# EAGLE design Mainboard (EAGLE 9.3.0)

## Sheet 1 of 3: Pro Micro and Misc. IO
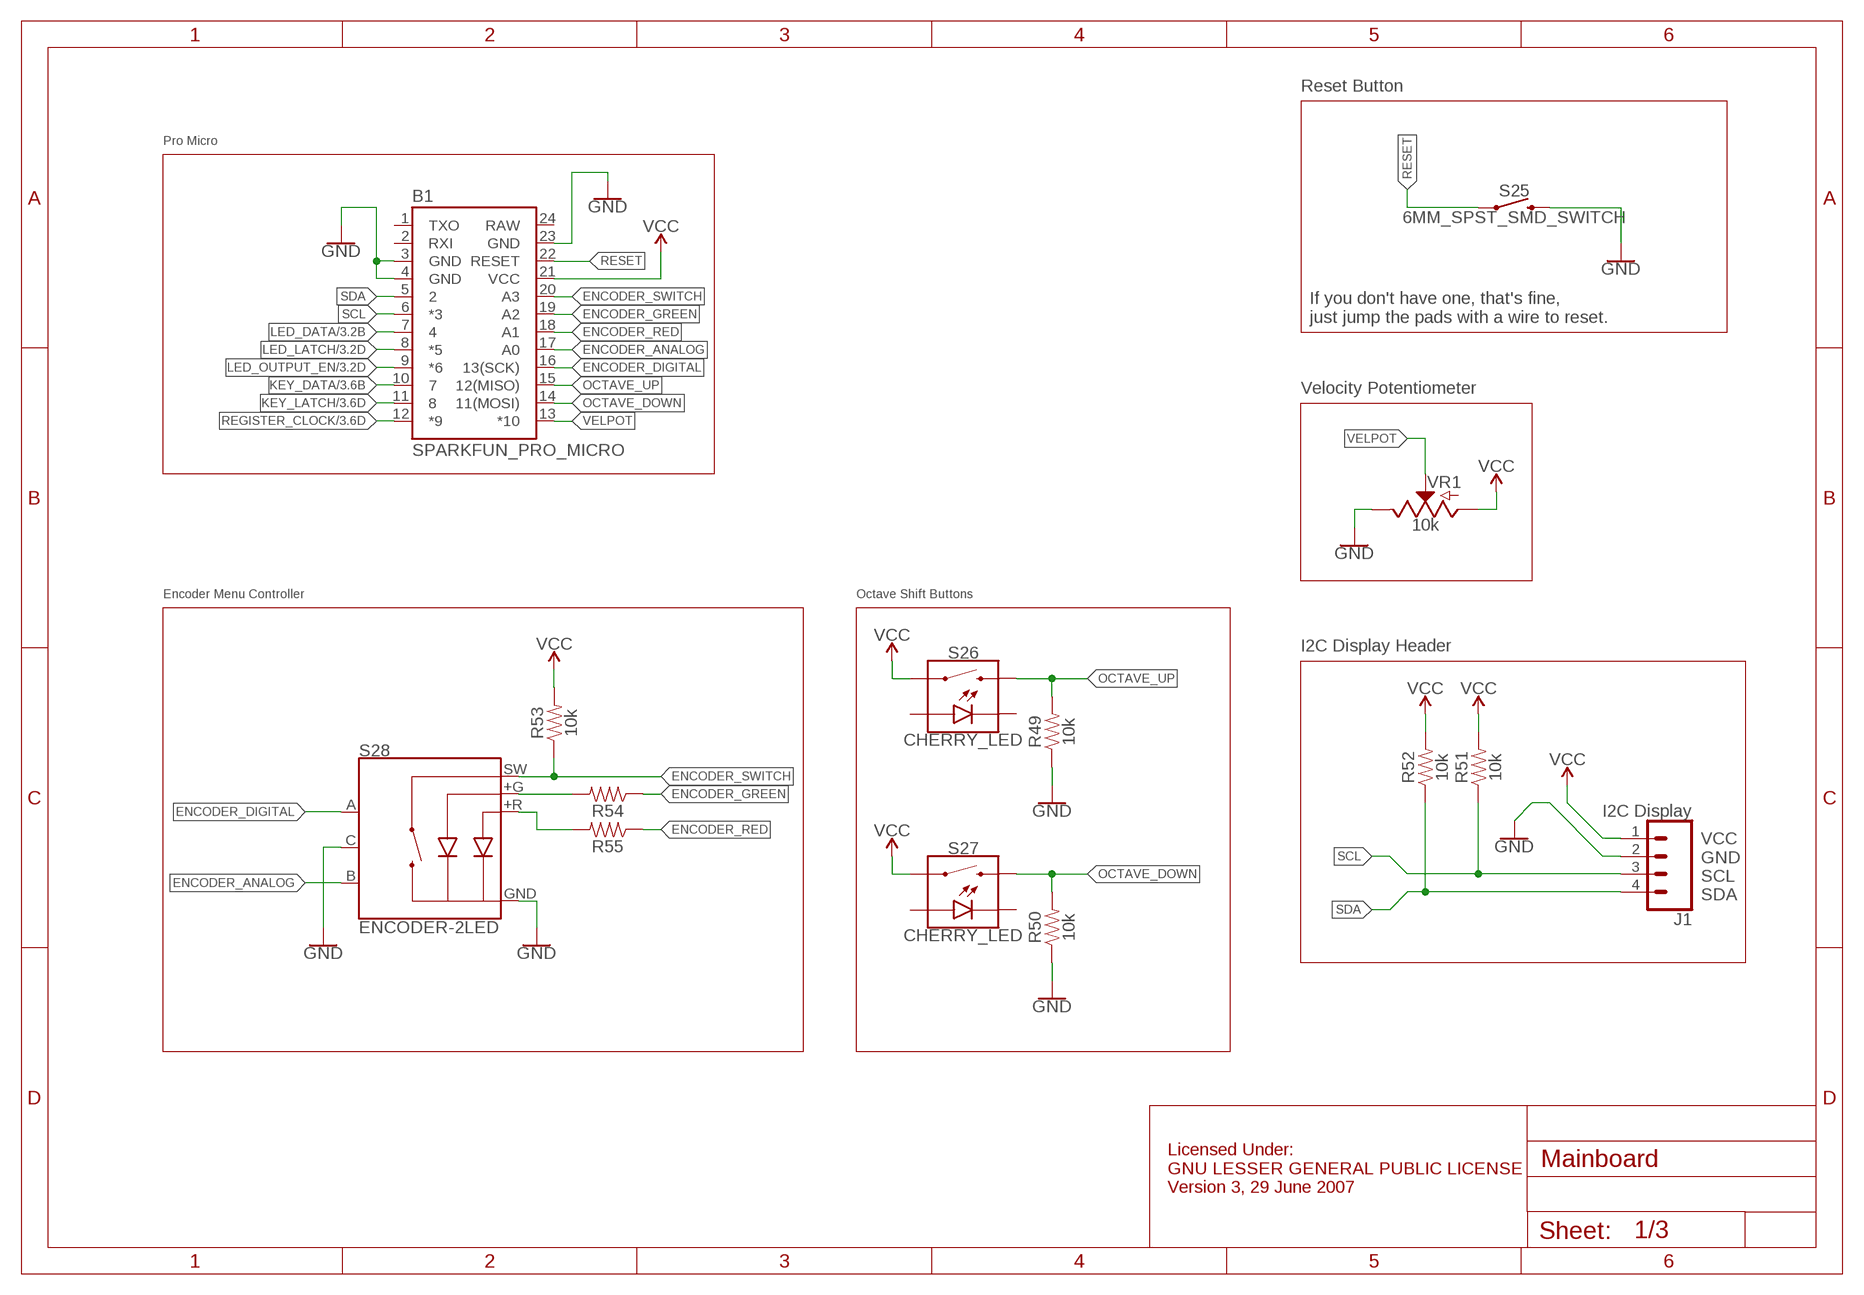
[diagram p0: schematic, sheet 1]

### Parts
B1  SPARKFUN_PRO_MICRO  [SPARKFUN_PRO_MICRO]
J1  I2C Display  CONN_04  [1X04]
R49  10k  10KOHM-HORIZ-1/4W-1%  [AXIAL-0.3]
R50  10k  10KOHM-HORIZ-1/4W-1%  [AXIAL-0.3]
R51  10k  10KOHM-HORIZ-1/4W-1%  [AXIAL-0.3]
R52  10k  10KOHM-HORIZ-1/4W-1%  [AXIAL-0.3]
R53  10k  10KOHM-HORIZ-1/4W-1%  [AXIAL-0.3]
R54  RESISTORAXIAL-0.3  [AXIAL-0.3]
R55  RESISTORAXIAL-0.3  [AXIAL-0.3]
S25  6MM_SPST_SMD_SWITCH  MOMENTARY-SWITCH-SPST-SMD-6.0X3.5MM  [TACTILE_SWITCH_SMD_6.0X3.5MM]
S26  CHERRY_LED  MOMENTARY-SWITCH-SPST-LED-PTH-CHERRY  [CHERRY-MX-LED]
S27  CHERRY_LED  MOMENTARY-SWITCH-SPST-LED-PTH-CHERRY  [CHERRY-MX-LED]
S28  ENCODER-2LED  [ENCODER_LED_2]
VR1  10k  POTENTIOMETER-PTH-9MM-1/20W-20%  [POT-PTH-ALPS]

### Nets
ENCODER_ANALOG: B1.17(A0) S28.B
ENCODER_DIGITAL: B1.16(13(SCK)) S28.A
ENCODER_GREEN: B1.19(A2) R54.P$1
ENCODER_RED: B1.18(A1) R55.P$1
ENCODER_SWITCH: B1.20(A3) R53.P$1 S28.SW
GND: B1.3(GND) B1.4(GND) B1.23(GND) J1.2 R49.P$1 R50.P$1 S25.2 S28.C S28.GND(-) VR1.P$1(E) ; also sheet 2,3
KEY_DATA: B1.10 ; also sheet 3
KEY_LATCH: B1.11 ; also sheet 3
LED_DATA: B1.7 ; also sheet 3
LED_LATCH: B1.8(*5) ; also sheet 3
LED_OUTPUT_EN: B1.9(*6) ; also sheet 3
N$25: R54.P$2 S28.+G
N$26: R55.P$2 S28.+R
OCTAVE_DOWN: B1.14(11(MOSI)) R50.P$2 S27.S2
OCTAVE_UP: B1.15(12(MISO)) R49.P$2 S26.S2
REGISTER_CLOCK: B1.12(*9) ; also sheet 3
RESET: B1.22(RESET) S25.1
SCL: B1.6(*3) J1.3 R51.P$1
SDA: B1.5 J1.4 R52.P$1
VCC: B1.21(VCC) J1.1 R51.P$2 R52.P$2 R53.P$2 S26.S1 S27.S1 VR1.P$3(A) ; also sheet 2,3
VELPOT: B1.13(*10) VR1.P$2(S)
Unconnected: B1.1(TXO) B1.2(RXI) S26.A S26.K(C) S27.A S27.K(C)

### Notes on the sheet
- Reset Button
- Pro Micro
- If you don't have one, that's fine,
  just jump the pads with a wire to reset.
- Velocity Potentiometer
- Encoder Menu Controller | Octave Shift Buttons
- I2C Display Header
- VCC
  GND
  SCL
  SDA
- Licensed Under:
  GNU LESSER GENERAL PUBLIC LICENSE
  Version 3, 29 June 2007

## Sheet 2 of 3: Keyswitches
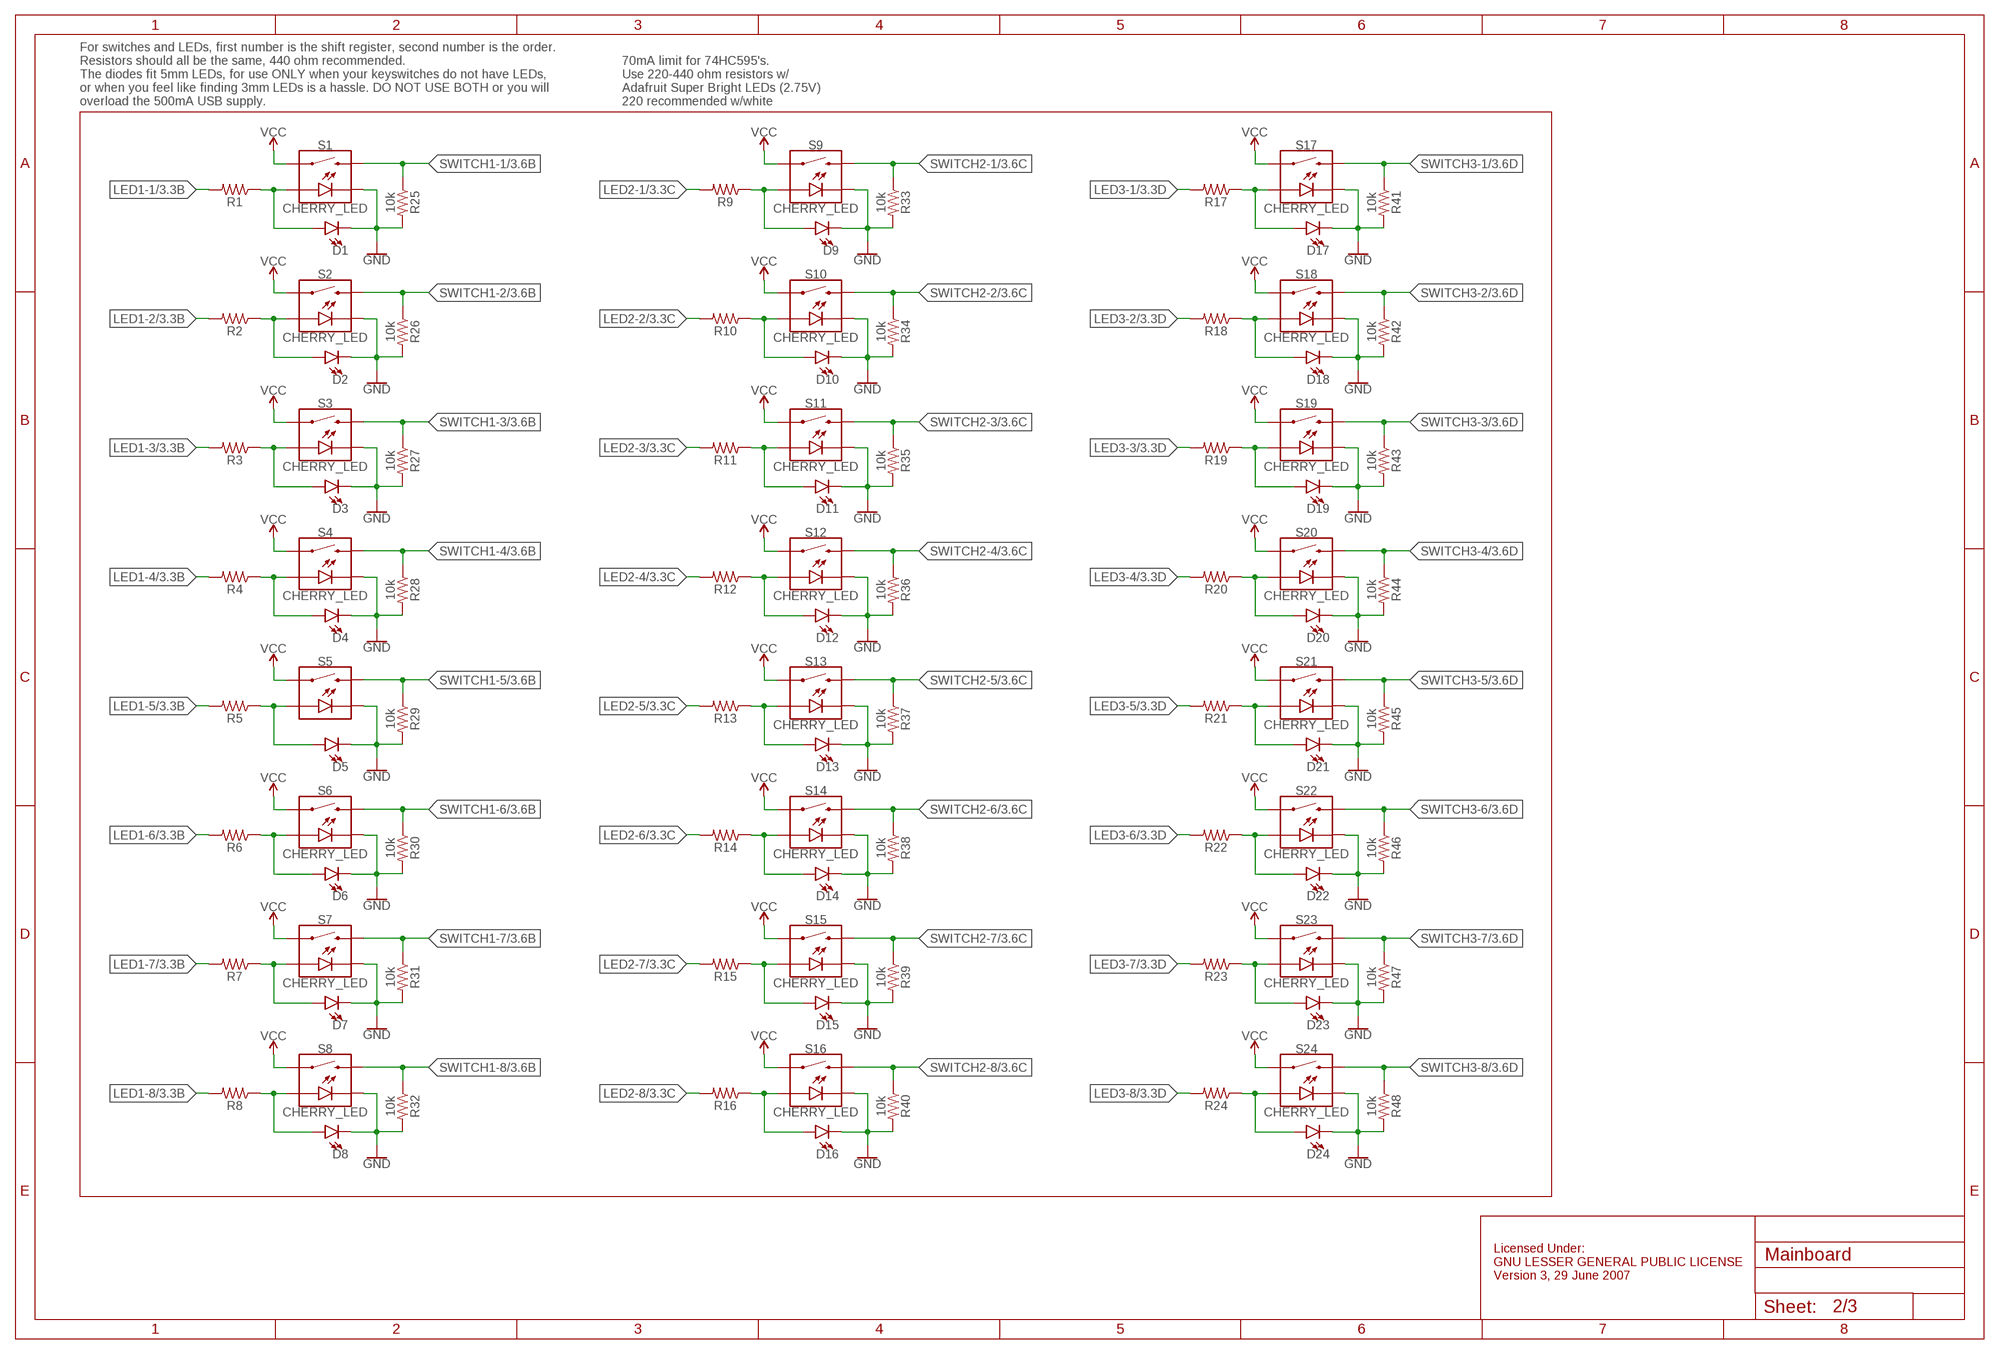
[diagram p1: schematic, sheet 2]

### Parts
D1  LED5MM  [LED_5MM]
D2  LED5MM  [LED_5MM]
D3  LED5MM  [LED_5MM]
D4  LED5MM  [LED_5MM]
D5  LED5MM  [LED_5MM]
D6  LED5MM  [LED_5MM]
D7  LED5MM  [LED_5MM]
D8  LED5MM  [LED_5MM]
D9  LED5MM  [LED_5MM]
D10  LED5MM  [LED_5MM]
D11  LED5MM  [LED_5MM]
D12  LED5MM  [LED_5MM]
D13  LED5MM  [LED_5MM]
D14  LED5MM  [LED_5MM]
D15  LED5MM  [LED_5MM]
D16  LED5MM  [LED_5MM]
D17  LED5MM  [LED_5MM]
D18  LED5MM  [LED_5MM]
D19  LED5MM  [LED_5MM]
D20  LED5MM  [LED_5MM]
D21  LED5MM  [LED_5MM]
D22  LED5MM  [LED_5MM]
D23  LED5MM  [LED_5MM]
D24  LED5MM  [LED_5MM]
R1  RESISTORAXIAL-0.3  [AXIAL-0.3]
R2  RESISTORAXIAL-0.3  [AXIAL-0.3]
R3  RESISTORAXIAL-0.3  [AXIAL-0.3]
R4  RESISTORAXIAL-0.3  [AXIAL-0.3]
R5  RESISTORAXIAL-0.3  [AXIAL-0.3]
R6  RESISTORAXIAL-0.3  [AXIAL-0.3]
R7  RESISTORAXIAL-0.3  [AXIAL-0.3]
R8  RESISTORAXIAL-0.3  [AXIAL-0.3]
R9  RESISTORAXIAL-0.3  [AXIAL-0.3]
R10  RESISTORAXIAL-0.3  [AXIAL-0.3]
R11  RESISTORAXIAL-0.3  [AXIAL-0.3]
R12  RESISTORAXIAL-0.3  [AXIAL-0.3]
R13  RESISTORAXIAL-0.3  [AXIAL-0.3]
R14  RESISTORAXIAL-0.3  [AXIAL-0.3]
R15  RESISTORAXIAL-0.3  [AXIAL-0.3]
R16  RESISTORAXIAL-0.3  [AXIAL-0.3]
R17  RESISTORAXIAL-0.3  [AXIAL-0.3]
R18  RESISTORAXIAL-0.3  [AXIAL-0.3]
R19  RESISTORAXIAL-0.3  [AXIAL-0.3]
R20  RESISTORAXIAL-0.3  [AXIAL-0.3]
R21  RESISTORAXIAL-0.3  [AXIAL-0.3]
R22  RESISTORAXIAL-0.3  [AXIAL-0.3]
R23  RESISTORAXIAL-0.3  [AXIAL-0.3]
R24  RESISTORAXIAL-0.3  [AXIAL-0.3]
R25  10k  10KOHM-HORIZ-1/4W-1%  [AXIAL-0.3]
R26  10k  10KOHM-HORIZ-1/4W-1%  [AXIAL-0.3]
R27  10k  10KOHM-HORIZ-1/4W-1%  [AXIAL-0.3]
R28  10k  10KOHM-HORIZ-1/4W-1%  [AXIAL-0.3]
R29  10k  10KOHM-HORIZ-1/4W-1%  [AXIAL-0.3]
R30  10k  10KOHM-HORIZ-1/4W-1%  [AXIAL-0.3]
R31  10k  10KOHM-HORIZ-1/4W-1%  [AXIAL-0.3]
R32  10k  10KOHM-HORIZ-1/4W-1%  [AXIAL-0.3]
R33  10k  10KOHM-HORIZ-1/4W-1%  [AXIAL-0.3]
R34  10k  10KOHM-HORIZ-1/4W-1%  [AXIAL-0.3]
R35  10k  10KOHM-HORIZ-1/4W-1%  [AXIAL-0.3]
R36  10k  10KOHM-HORIZ-1/4W-1%  [AXIAL-0.3]
R37  10k  10KOHM-HORIZ-1/4W-1%  [AXIAL-0.3]
R38  10k  10KOHM-HORIZ-1/4W-1%  [AXIAL-0.3]
R39  10k  10KOHM-HORIZ-1/4W-1%  [AXIAL-0.3]
R40  10k  10KOHM-HORIZ-1/4W-1%  [AXIAL-0.3]
R41  10k  10KOHM-HORIZ-1/4W-1%  [AXIAL-0.3]
R42  10k  10KOHM-HORIZ-1/4W-1%  [AXIAL-0.3]
R43  10k  10KOHM-HORIZ-1/4W-1%  [AXIAL-0.3]
R44  10k  10KOHM-HORIZ-1/4W-1%  [AXIAL-0.3]
R45  10k  10KOHM-HORIZ-1/4W-1%  [AXIAL-0.3]
R46  10k  10KOHM-HORIZ-1/4W-1%  [AXIAL-0.3]
R47  10k  10KOHM-HORIZ-1/4W-1%  [AXIAL-0.3]
R48  10k  10KOHM-HORIZ-1/4W-1%  [AXIAL-0.3]
S1  CHERRY_LED  MOMENTARY-SWITCH-SPST-LED-PTH-CHERRY  [CHERRY-MX-LED]
S2  CHERRY_LED  MOMENTARY-SWITCH-SPST-LED-PTH-CHERRY  [CHERRY-MX-LED]
S3  CHERRY_LED  MOMENTARY-SWITCH-SPST-LED-PTH-CHERRY  [CHERRY-MX-LED]
S4  CHERRY_LED  MOMENTARY-SWITCH-SPST-LED-PTH-CHERRY  [CHERRY-MX-LED]
S5  MOMENTARY-SWITCH-SPST-LED-PTH-CHERRY  [CHERRY-MX-LED]
S6  CHERRY_LED  MOMENTARY-SWITCH-SPST-LED-PTH-CHERRY  [CHERRY-MX-LED]
S7  CHERRY_LED  MOMENTARY-SWITCH-SPST-LED-PTH-CHERRY  [CHERRY-MX-LED]
S8  CHERRY_LED  MOMENTARY-SWITCH-SPST-LED-PTH-CHERRY  [CHERRY-MX-LED]
S9  CHERRY_LED  MOMENTARY-SWITCH-SPST-LED-PTH-CHERRY  [CHERRY-MX-LED]
S10  CHERRY_LED  MOMENTARY-SWITCH-SPST-LED-PTH-CHERRY  [CHERRY-MX-LED]
S11  CHERRY_LED  MOMENTARY-SWITCH-SPST-LED-PTH-CHERRY  [CHERRY-MX-LED]
S12  CHERRY_LED  MOMENTARY-SWITCH-SPST-LED-PTH-CHERRY  [CHERRY-MX-LED]
S13  CHERRY_LED  MOMENTARY-SWITCH-SPST-LED-PTH-CHERRY  [CHERRY-MX-LED]
S14  CHERRY_LED  MOMENTARY-SWITCH-SPST-LED-PTH-CHERRY  [CHERRY-MX-LED]
S15  CHERRY_LED  MOMENTARY-SWITCH-SPST-LED-PTH-CHERRY  [CHERRY-MX-LED]
S16  CHERRY_LED  MOMENTARY-SWITCH-SPST-LED-PTH-CHERRY  [CHERRY-MX-LED]
S17  CHERRY_LED  MOMENTARY-SWITCH-SPST-LED-PTH-CHERRY  [CHERRY-MX-LED]
S18  CHERRY_LED  MOMENTARY-SWITCH-SPST-LED-PTH-CHERRY  [CHERRY-MX-LED]
S19  CHERRY_LED  MOMENTARY-SWITCH-SPST-LED-PTH-CHERRY  [CHERRY-MX-LED]
S20  CHERRY_LED  MOMENTARY-SWITCH-SPST-LED-PTH-CHERRY  [CHERRY-MX-LED]
S21  CHERRY_LED  MOMENTARY-SWITCH-SPST-LED-PTH-CHERRY  [CHERRY-MX-LED]
S22  CHERRY_LED  MOMENTARY-SWITCH-SPST-LED-PTH-CHERRY  [CHERRY-MX-LED]
S23  CHERRY_LED  MOMENTARY-SWITCH-SPST-LED-PTH-CHERRY  [CHERRY-MX-LED]
S24  CHERRY_LED  MOMENTARY-SWITCH-SPST-LED-PTH-CHERRY  [CHERRY-MX-LED]

### Nets
GND: D1.K(C) D2.K(C) D3.K(C) D4.K(C) D5.K(C) D6.K(C) D7.K(C) D8.K(C) D9.K(C) D10.K(C) D11.K(C) D12.K(C) D13.K(C) D14.K(C) D15.K(C) D16.K(C) D17.K(C) D18.K(C) D19.K(C) D20.K(C) D21.K(C) D22.K(C) D23.K(C) D24.K(C) R25.P$2 R26.P$2 R27.P$2 R28.P$2 R29.P$2 R30.P$2 R31.P$2 R32.P$2 R33.P$2 R34.P$2 R35.P$2 R36.P$2 R37.P$2 R38.P$2 R39.P$2 R40.P$2 R41.P$2 R42.P$2 R43.P$2 R44.P$2 R45.P$2 R46.P$2 R47.P$2 R48.P$2 S1.K(C) S2.K(C) S3.K(C) S4.K(C) S5.K(C) S6.K(C) S7.K(C) S8.K(C) S9.K(C) S10.K(C) S11.K(C) S12.K(C) S13.K(C) S14.K(C) S15.K(C) S16.K(C) S17.K(C) S18.K(C) S19.K(C) S20.K(C) S21.K(C) S22.K(C) S23.K(C) S24.K(C) ; also sheet 1,3
LED1-1: R1.P$2 ; also sheet 3
LED1-2: R2.P$2 ; also sheet 3
LED1-3: R3.P$2 ; also sheet 3
LED1-4: R4.P$2 ; also sheet 3
LED1-5: R5.P$2 ; also sheet 3
LED1-6: R6.P$2 ; also sheet 3
LED1-7: R7.P$2 ; also sheet 3
LED1-8: R8.P$2 ; also sheet 3
LED2-1: R9.P$2 ; also sheet 3
LED2-2: R10.P$2 ; also sheet 3
LED2-3: R11.P$2 ; also sheet 3
LED2-4: R12.P$2 ; also sheet 3
LED2-5: R13.P$2 ; also sheet 3
LED2-6: R14.P$2 ; also sheet 3
LED2-7: R15.P$2 ; also sheet 3
LED2-8: R16.P$2 ; also sheet 3
LED3-1: R17.P$2 ; also sheet 3
LED3-2: R18.P$2 ; also sheet 3
LED3-3: R19.P$2 ; also sheet 3
LED3-4: R20.P$2 ; also sheet 3
LED3-5: R21.P$2 ; also sheet 3
LED3-6: R22.P$2 ; also sheet 3
LED3-7: R23.P$2 ; also sheet 3
LED3-8: R24.P$2 ; also sheet 3
N$1: D1.A R1.P$1 S1.A
N$2: D2.A R2.P$1 S2.A
N$3: D3.A R3.P$1 S3.A
N$4: D4.A R4.P$1 S4.A
N$5: D5.A R5.P$1 S5.A
N$6: D6.A R6.P$1 S6.A
N$7: D7.A R7.P$1 S7.A
N$8: D8.A R8.P$1 S8.A
N$9: D9.A R9.P$1 S9.A
N$10: D10.A R10.P$1 S10.A
N$11: D11.A R11.P$1 S11.A
N$12: D12.A R12.P$1 S12.A
N$13: D13.A R13.P$1 S13.A
N$14: D14.A R14.P$1 S14.A
N$15: D15.A R15.P$1 S15.A
N$16: D16.A R16.P$1 S16.A
N$17: D17.A R17.P$1 S17.A
N$18: D18.A R18.P$1 S18.A
N$19: D19.A R19.P$1 S19.A
N$20: D20.A R20.P$1 S20.A
N$21: D21.A R21.P$1 S21.A
N$22: D22.A R22.P$1 S22.A
N$23: D23.A R23.P$1 S23.A
N$24: D24.A R24.P$1 S24.A
SWITCH1-1: R25.P$1 S1.S2 ; also sheet 3
SWITCH1-2: R26.P$1 S2.S2 ; also sheet 3
SWITCH1-3: R27.P$1 S3.S2 ; also sheet 3
SWITCH1-4: R28.P$1 S4.S2 ; also sheet 3
SWITCH1-5: R29.P$1 S5.S2 ; also sheet 3
SWITCH1-6: R30.P$1 S6.S2 ; also sheet 3
SWITCH1-7: R31.P$1 S7.S2 ; also sheet 3
SWITCH1-8: R32.P$1 S8.S2 ; also sheet 3
SWITCH2-1: R33.P$1 S9.S2 ; also sheet 3
SWITCH2-2: R34.P$1 S10.S2 ; also sheet 3
SWITCH2-3: R35.P$1 S11.S2 ; also sheet 3
SWITCH2-4: R36.P$1 S12.S2 ; also sheet 3
SWITCH2-5: R37.P$1 S13.S2 ; also sheet 3
SWITCH2-6: R38.P$1 S14.S2 ; also sheet 3
SWITCH2-7: R39.P$1 S15.S2 ; also sheet 3
SWITCH2-8: R40.P$1 S16.S2 ; also sheet 3
SWITCH3-1: R41.P$1 S17.S2 ; also sheet 3
SWITCH3-2: R42.P$1 S18.S2 ; also sheet 3
SWITCH3-3: R43.P$1 S19.S2 ; also sheet 3
SWITCH3-4: R44.P$1 S20.S2 ; also sheet 3
SWITCH3-5: R45.P$1 S21.S2 ; also sheet 3
SWITCH3-6: R46.P$1 S22.S2 ; also sheet 3
SWITCH3-7: R47.P$1 S23.S2 ; also sheet 3
SWITCH3-8: R48.P$1 S24.S2 ; also sheet 3
VCC: S1.S1 S2.S1 S3.S1 S4.S1 S5.S1 S6.S1 S7.S1 S8.S1 S9.S1 S10.S1 S11.S1 S12.S1 S13.S1 S14.S1 S15.S1 S16.S1 S17.S1 S18.S1 S19.S1 S20.S1 S21.S1 S22.S1 S23.S1 S24.S1 ; also sheet 1,3

### Notes on the sheet
- For switches and LEDs, first number is the shift register, second number is the order.
  Resistors should all be the same, 440 ohm recommended. 
  The diodes fit 5mm LEDs, for use ONLY when your keyswitches do not have LEDs,
  or when you feel like finding 3mm LEDs is a hassle. DO NOT USE BOTH or you will
  overload the 500mA USB supply.
- 70mA limit for 74HC595's.
  Use 220-440 ohm resistors w/ 
  Adafruit Super Bright LEDs (2.75V)
  220 recommended w/white
- Licensed Under:
  GNU LESSER GENERAL PUBLIC LICENSE
  Version 3, 29 June 2007

## Sheet 3 of 3: Shift Registers
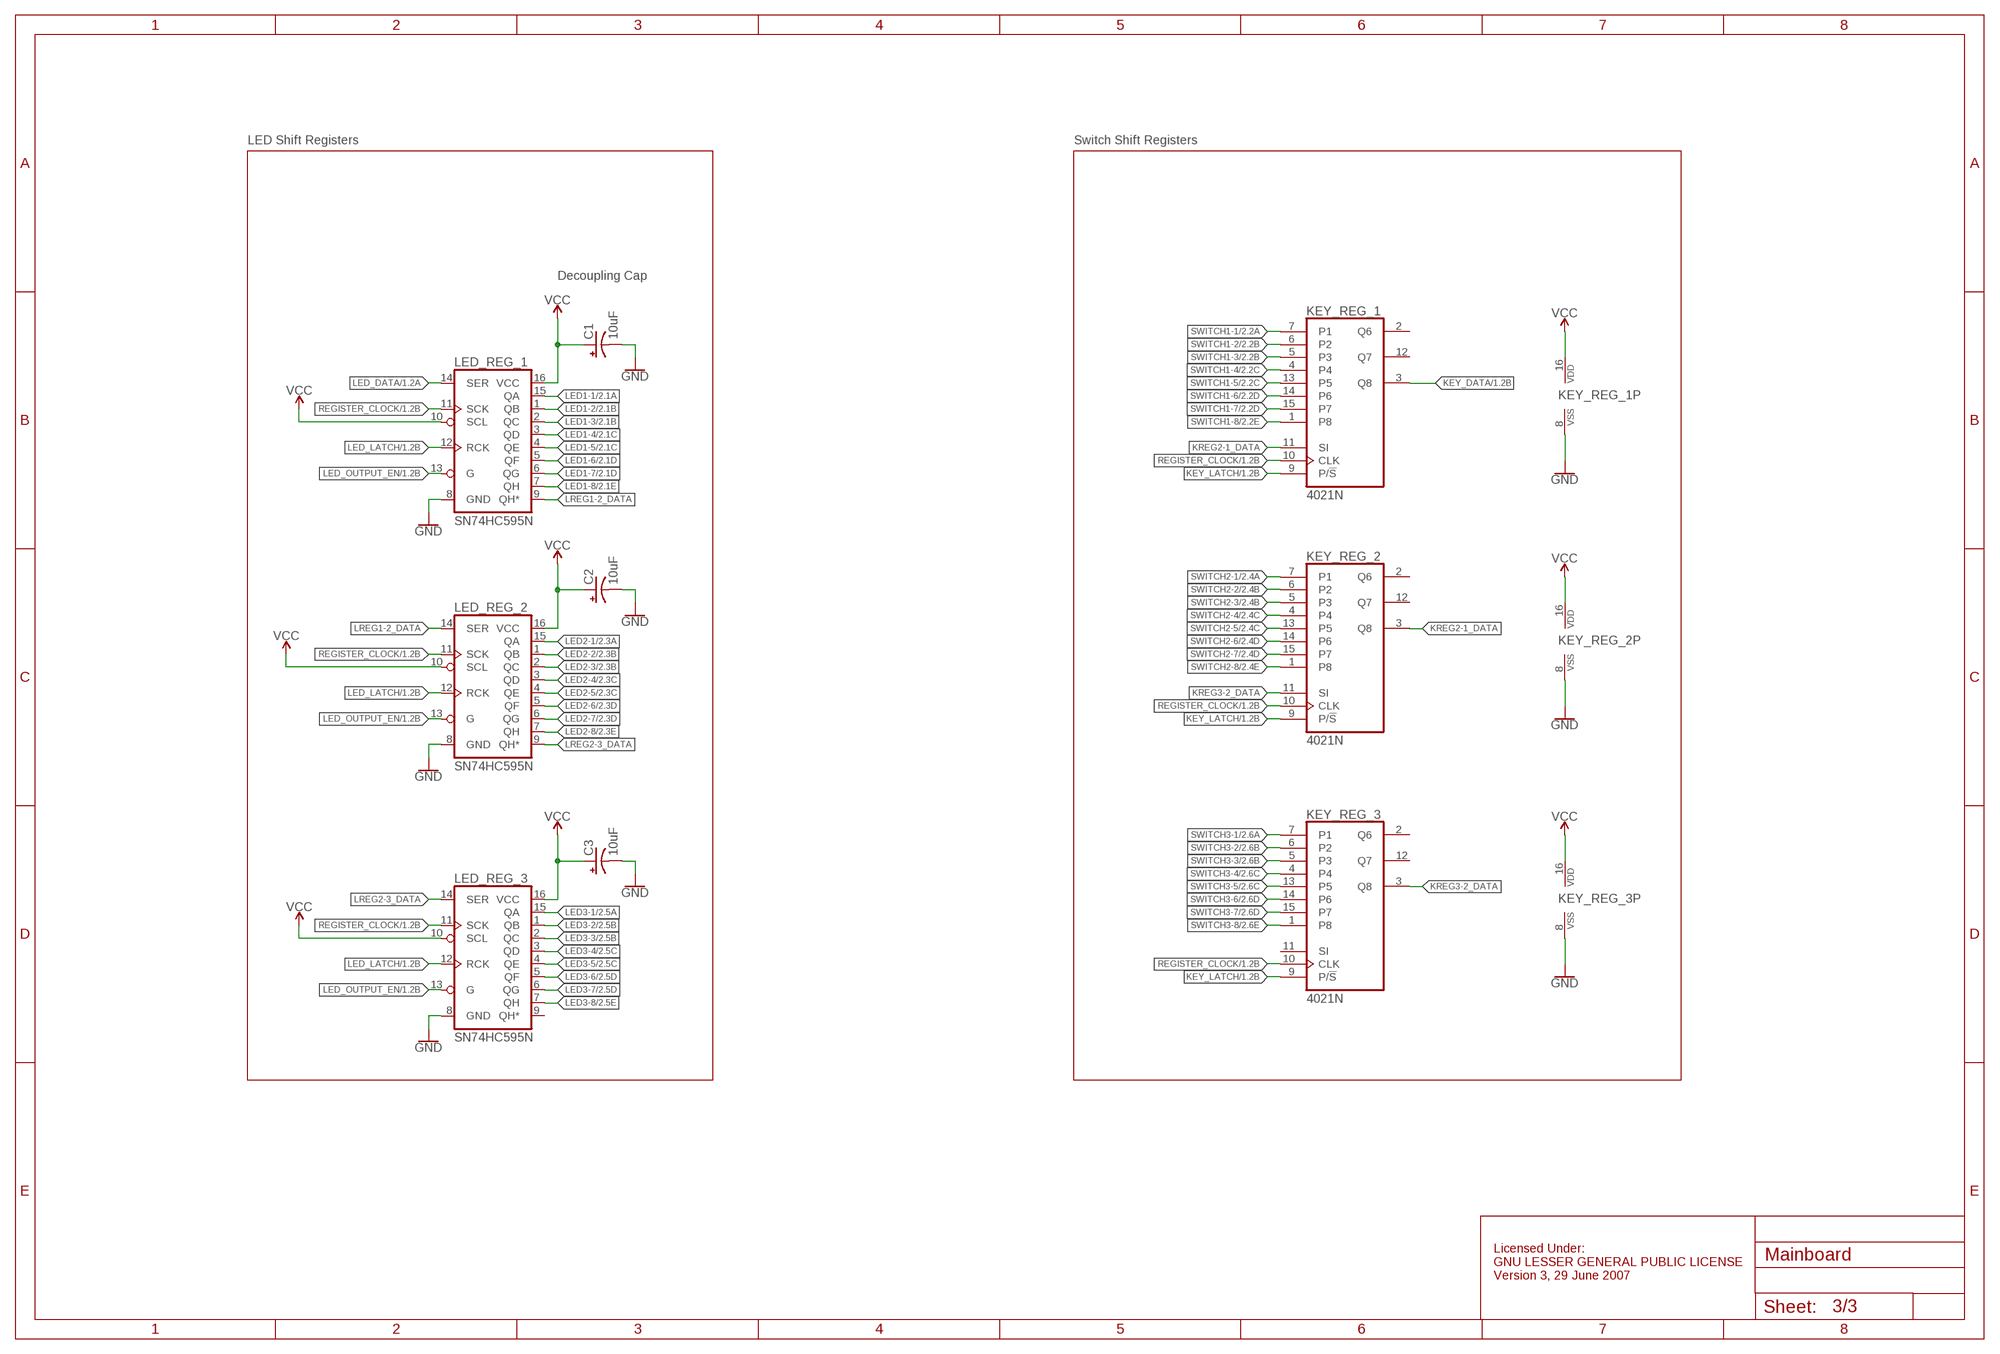
[diagram p2: schematic, sheet 3]

### Parts
C1  10uF  10UF-POLAR-RADIAL-2.5MM-25V-20%  [CPOL-RADIAL-2.5MM-5MM]
C2  10uF  10UF-POLAR-RADIAL-2.5MM-25V-20%  [CPOL-RADIAL-2.5MM-5MM]
C3  10uF  10UF-POLAR-RADIAL-2.5MM-25V-20%  [CPOL-RADIAL-2.5MM-5MM]
KEY_REG_1  4021N  [DIL16]
KEY_REG_2  4021N  [DIL16]
KEY_REG_3  4021N  [DIL16]
LED_REG_1  SN74HC595N  74HC595N  [DIP16]
LED_REG_2  SN74HC595N  74HC595N  [DIP16]
LED_REG_3  SN74HC595N  74HC595N  [DIP16]

### Nets
GND: C1.2(-) C2.2(-) C3.2(-) KEY_REG_1.8(VSS) KEY_REG_2.8(VSS) KEY_REG_3.8(VSS) LED_REG_1.8(GND) LED_REG_2.8(GND) LED_REG_3.8(GND) ; also sheet 1,2
KEY_DATA: KEY_REG_1.3(Q8) ; also sheet 1
KEY_LATCH: KEY_REG_1.9(P/!S) KEY_REG_2.9(P/!S) KEY_REG_3.9(P/!S) ; also sheet 1
KREG2-1_DATA: KEY_REG_1.11(SI) KEY_REG_2.3(Q8)
KREG3-2_DATA: KEY_REG_2.11(SI) KEY_REG_3.3(Q8)
LED1-1: LED_REG_1.15(QA) ; also sheet 2
LED1-2: LED_REG_1.1(QB) ; also sheet 2
LED1-3: LED_REG_1.2(QC) ; also sheet 2
LED1-4: LED_REG_1.3(QD) ; also sheet 2
LED1-5: LED_REG_1.4(QE) ; also sheet 2
LED1-6: LED_REG_1.5(QF) ; also sheet 2
LED1-7: LED_REG_1.6(QG) ; also sheet 2
LED1-8: LED_REG_1.7(QH) ; also sheet 2
LED2-1: LED_REG_2.15(QA) ; also sheet 2
LED2-2: LED_REG_2.1(QB) ; also sheet 2
LED2-3: LED_REG_2.2(QC) ; also sheet 2
LED2-4: LED_REG_2.3(QD) ; also sheet 2
LED2-5: LED_REG_2.4(QE) ; also sheet 2
LED2-6: LED_REG_2.5(QF) ; also sheet 2
LED2-7: LED_REG_2.6(QG) ; also sheet 2
LED2-8: LED_REG_2.7(QH) ; also sheet 2
LED3-1: LED_REG_3.15(QA) ; also sheet 2
LED3-2: LED_REG_3.1(QB) ; also sheet 2
LED3-3: LED_REG_3.2(QC) ; also sheet 2
LED3-4: LED_REG_3.3(QD) ; also sheet 2
LED3-5: LED_REG_3.4(QE) ; also sheet 2
LED3-6: LED_REG_3.5(QF) ; also sheet 2
LED3-7: LED_REG_3.6(QG) ; also sheet 2
LED3-8: LED_REG_3.7(QH) ; also sheet 2
LED_DATA: LED_REG_1.14(SER) ; also sheet 1
LED_LATCH: LED_REG_1.12(RCK) LED_REG_2.12(RCK) LED_REG_3.12(RCK) ; also sheet 1
LED_OUTPUT_EN: LED_REG_1.13(G) LED_REG_2.13(G) LED_REG_3.13(G) ; also sheet 1
LREG1-2_DATA: LED_REG_1.9(QH*) LED_REG_2.14(SER)
LREG2-3_DATA: LED_REG_2.9(QH*) LED_REG_3.14(SER)
REGISTER_CLOCK: KEY_REG_1.10(CLK) KEY_REG_2.10(CLK) KEY_REG_3.10(CLK) LED_REG_1.11(SCK) LED_REG_2.11(SCK) LED_REG_3.11(SCK) ; also sheet 1
SWITCH1-1: KEY_REG_1.7(P1) ; also sheet 2
SWITCH1-2: KEY_REG_1.6(P2) ; also sheet 2
SWITCH1-3: KEY_REG_1.5(P3) ; also sheet 2
SWITCH1-4: KEY_REG_1.4 ; also sheet 2
SWITCH1-5: KEY_REG_1.13(P5) ; also sheet 2
SWITCH1-6: KEY_REG_1.14(P6) ; also sheet 2
SWITCH1-7: KEY_REG_1.15(P7) ; also sheet 2
SWITCH1-8: KEY_REG_1.1(P8) ; also sheet 2
SWITCH2-1: KEY_REG_2.7(P1) ; also sheet 2
SWITCH2-2: KEY_REG_2.6(P2) ; also sheet 2
SWITCH2-3: KEY_REG_2.5(P3) ; also sheet 2
SWITCH2-4: KEY_REG_2.4 ; also sheet 2
SWITCH2-5: KEY_REG_2.13(P5) ; also sheet 2
SWITCH2-6: KEY_REG_2.14(P6) ; also sheet 2
SWITCH2-7: KEY_REG_2.15(P7) ; also sheet 2
SWITCH2-8: KEY_REG_2.1(P8) ; also sheet 2
SWITCH3-1: KEY_REG_3.7(P1) ; also sheet 2
SWITCH3-2: KEY_REG_3.6(P2) ; also sheet 2
SWITCH3-3: KEY_REG_3.5(P3) ; also sheet 2
SWITCH3-4: KEY_REG_3.4 ; also sheet 2
SWITCH3-5: KEY_REG_3.13(P5) ; also sheet 2
SWITCH3-6: KEY_REG_3.14(P6) ; also sheet 2
SWITCH3-7: KEY_REG_3.15(P7) ; also sheet 2
SWITCH3-8: KEY_REG_3.1(P8) ; also sheet 2
VCC: C1.1(+) C2.1(+) C3.1(+) KEY_REG_1.16(VDD) KEY_REG_2.16(VDD) KEY_REG_3.16(VDD) LED_REG_1.10(SCL) LED_REG_1.16(VCC) LED_REG_2.10(SCL) LED_REG_2.16(VCC) LED_REG_3.10(SCL) LED_REG_3.16(VCC) ; also sheet 1,2
Unconnected: KEY_REG_1.2(Q6) KEY_REG_1.12(Q7) KEY_REG_2.2(Q6) KEY_REG_2.12(Q7) KEY_REG_3.2(Q6) KEY_REG_3.11(SI) KEY_REG_3.12(Q7) LED_REG_3.9(QH*)

### Notes on the sheet
- LED Shift Registers | Switch Shift Registers
- Decoupling Cap
- Licensed Under:
  GNU LESSER GENERAL PUBLIC LICENSE
  Version 3, 29 June 2007

## Power pins joined to a net without a drawn wire
RAW: B1.24(RAW)

## Library data of the parts
B1 = SparkFun-Boards:SPARKFUN_PRO_MICRO: SparkFun Pro Micro Atmega32U4 compatible footprint. SparkFun Products: 3.3V/8MHz <https://www.sparkfun.com/products/12587> 5V/16MHz <https://www.sparkfun.com/products/12640>
C1-C3 = SparkFun-Capacitors:10UF-POLAR: 10.0µF polarized capacitors A capacitor is a passive two-terminal electrical component used to store electrical energy temporarily in an electric field.; PROD_ID: CAP-08440
D1-D24 = SparkFun-LED:LED: LED (Generic) Standard schematic elements and footprints for 5mm, 3mm, 1206, and 0603 sized LEDs. Generic LEDs with no color specified.
J1 = SparkFun-Connectors:CONN_04: Multi connection point. Often used as Generic Header-pin footprint for 0.1 inch spaced/style header connections On any of the 0.1 inch spaced packages, you can populate with these: Break Away Headers - Straight <https://www.sparkfun.com/products/116> (PRT-00116) Break Away Male Headers - Right Angle <https://www.sparkfun.com/products/553> (PRT-00553) Female Headers <https://www.sparkfun.com/products/115> (PRT-00115) Break Away Headers - Machine Pin <https://www.sparkfun.com/products/117> (PRT-00117) Break Away Female Headers - Swiss Machine Pin <https://www.sparkfun.com/products/743> (PRT-00743) For SCREWTERMINALS and SPRING TERMINALS visit here: Screw Terimnals on SparkFun.com <https://www.sparkfun.com/search/results?term=Screw+Terminals> (5mm/3.5mm/2.54mm spacing) This device is also useful as a general connection point to wire up your design to another part of your project. Our various solder wires solder well into these plated through hole pads. Hook-Up Wire - Assortment (Stranded, 22 AWG) <https://www.sparkfun.com/products/11375> (PRT-11375) Hook-Up Wire - Assortment (Solid Core, 22 AWG) <https://www.sparkfun.com/products/11367> (PRT-11367) View the entire wire category on our website here <https://www.sparkfun.com/categories/141> Special notes: Molex polarized connector foot print use with SKU : PRT-08231 with associated crimp pins and housings. 1MM SMD Version SKU: PRT-10208; PROD_ID: CONN-09696
KEY_REG_1-KEY_REG_3 = 40xx:4021: 8-bit static SHIFT REGISTER
LED_REG_1-LED_REG_3 = SparkFun-IC-Logic:74*595: 8-Bit Shift Register (Serial to Parallel) Datasheet <http://cdn.sparkfun.com/datasheets/BreakoutBoards/MM74HC595.pdf> SparkFun Products SparkFun Shift Register Breakout - 74HC595 <https://www.sparkfun.com/products/10680> (BOB-10680); PROD_ID: IC-13123
R1-R24 R54 R55 = SparkFun-Resistors:RESISTOR: Generic Resistor Package
R25-R53 = SparkFun-Resistors:10KOHM: 10kΩ resistor A resistor is a passive two-terminal electrical component that implements electrical resistance as a circuit element. Resistors act to reduce current flow, and, at the same time, act to lower voltage levels within circuits. - Wikipedia; PROD_ID: RES-12183
S1-S24 S26 S27 = SparkFun-Switches:MOMENTARY-SWITCH-SPST-LED: Momentary Switch (Pushbutton) - SPST - w/ LED Normally-open (NO) SPST momentary switches (buttons, pushbuttons), with a built-in LED. Variants PTH-CHERRY - Cherry MX Switch Cherry MX Keyswitches are top-of-the-line mechanical keyboard switches. They’re satisfyingly “clicky”, reliable up to tens-of-millions of key presses, and a standard in gaming and programming keyboards across the globe. This ‘blue’ version Cherry MX Switch is favored by most due to its secondary internal actuator making it less likely to “double-tap.” If you are looking for a noticeably audible and high-quality key switch, this is the perfect option for you! Cherry MX Switch <https://www.sparkfun.com/products/13834> (COM-13834) Cherry MX Switch Breakout <https://www.sparkfun.com/products/13773> (BOB-13773) PTH-12MM and PTH-12MM-KIT - 12mm Illuminated LED KIT variant is for soldering kits. There is no tStop (covering up the top side of the pads with mask). This helps the beginner see which side they should be soldering too. LED Tactile Button Breakout <https://www.sparkfun.com/products/10467> (BOB-10467) LED Tactile Button - Red <https://www.sparkfun.com/products/10442> (COM-10442) LED Tactile Button - Blue <https://www.sparkfun.com/products/10443> (COM-10443) LED Tactile Button - Green <https://www.sparkfun.com/products/10440> (COM-10440) LED Tactile Button - Orange <https://www.sparkfun.com/products/10441> (COM-10441) LED Tactile Button - White <https://www.sparkfun.com/products/10439> (COM-10439); SF_ID: COM-13834
S25 = SparkFun-Switches:MOMENTARY-SWITCH-SPST: Momentary Switch (Pushbutton) - SPST Normally-open (NO) SPST momentary switches (buttons, pushbuttons). Variants PTH-12MM - 12mm square, through-hole Momentary Pushbutton Switch - 12mm Square <https://www.sparkfun.com/products/9190> (COM-09190) PTH-6.0MM, PTH-6.0MM-KIT - 6.0mm square, through-hole Mini Pushbutton Switch <https://www.sparkfun.com/products/97> (COM-00097) KIT package intended for soldering kit's - only one side of pads' copper is exposed. PTH-RIGHT-ANGLE-KIT - Right-angle, through-hole Right Angle Tactile Button <https://www.sparkfun.com/products/10791> - Used on SparkFun BigTime Watch Kit <https://www.sparkfun.com/products/11734> SMD-12MM - 12mm square, surface-mount Tactile Button - SMD (12mm) <https://www.sparkfun.com/products/12993> (COM-12993) Used on SparkFun PicoBoard <https://www.sparkfun.com/products/11888> SMD-4.5MM - 4.5mm Square Trackball Switch Used on SparkFun Blackberry Trackballer Breakout <https://www.sparkfun.com/products/13169> SMD-4.6MMX2.8MM - 4.60mm x 2.80mm, surface mount Used on SparkFun SAMD21 Mini Breakout <https://www.sparkfun.com/products/13664> SMD-5.2MM, SMD-5.2-REDUNDANT - 5.2mm square, surface-mount Mini Pushbutton Switch - SMD <https://www.sparkfun.com/products/8720> (COM-08720) Used on Arduino Pro Mini <https://www.sparkfun.com/products/11114> REDUNDANT package connects both switch circuits together SMD-6.0X3.5MM - 6.0 x 3.5mm, surface mount Momentary Reset Switch SMD <https://www.sparkfun.com/products/8229> (COM-08229) SMD-6.2MM-TALL - 6.2mm square, surface mount Tactile Button - SMD (6mm) <https://www.sparkfun.com/products/12992> Used on SparkFun Digital Sandbox <https://www.sparkfun.com/products/12651> SMD-RIGHT-ANGLE - Right-angle, surface mount Used on SparkFun Block for Intel® Edison - Arduino <https://www.sparkfun.com/products/13036>; PROD_ID: SWCH-00815; SF_SKU: COM-08229
S28 = SparkFun-Switches:ENCODER-2LED: Illuminated Rotary Encoder w/ 2 LEDs Rotary encoders rotate similarly to potentiometers, but they’re different from potentiometers in that an encoder has full rotation without limits. They output gray code so that you can tell how much and in which direction the encoder has been turned. This encoder has a red/green LED built-in, which shines through the encoder shaft. SparkFun Products Rotary Encoder - Illuminated (Red/Green) <https://www.sparkfun.com/products/10596> (COM-10596) SparkFun Rotary Encoder Breakout - Illuminated (RG/RGB) <https://www.sparkfun.com/products/11722> (BOB-11722); PROD_ID: COMP-11113; SF_SKU: COM-10596
VR1 = SparkFun-Resistors:POTENTIOMETER: Potentiometer (Pot) Three-terminal potentiometers, with an adjustable wiper and two adjustable resistors. A pot can be used to create a configurable voltage divider, or as a variable resistor. Variants ALPS_POT and ALPS_POT_KIT - PTH, breadboard compatible, 9mm square pots Rotary Potentiometer - Linear (10k ohm) <https://www.sparkfun.com/products/9288> (COM-09288) The KIT variant exposes copper on only one side of the PTH pad, so the part can only be assembled on one side of the PCB. Useful for beginner soldering kits.; PROD_ID: RES-09177; SF_SKU: COM-09288

## Net classes
0 default: width 0.305 mm, drill 0.3 mm

## Board
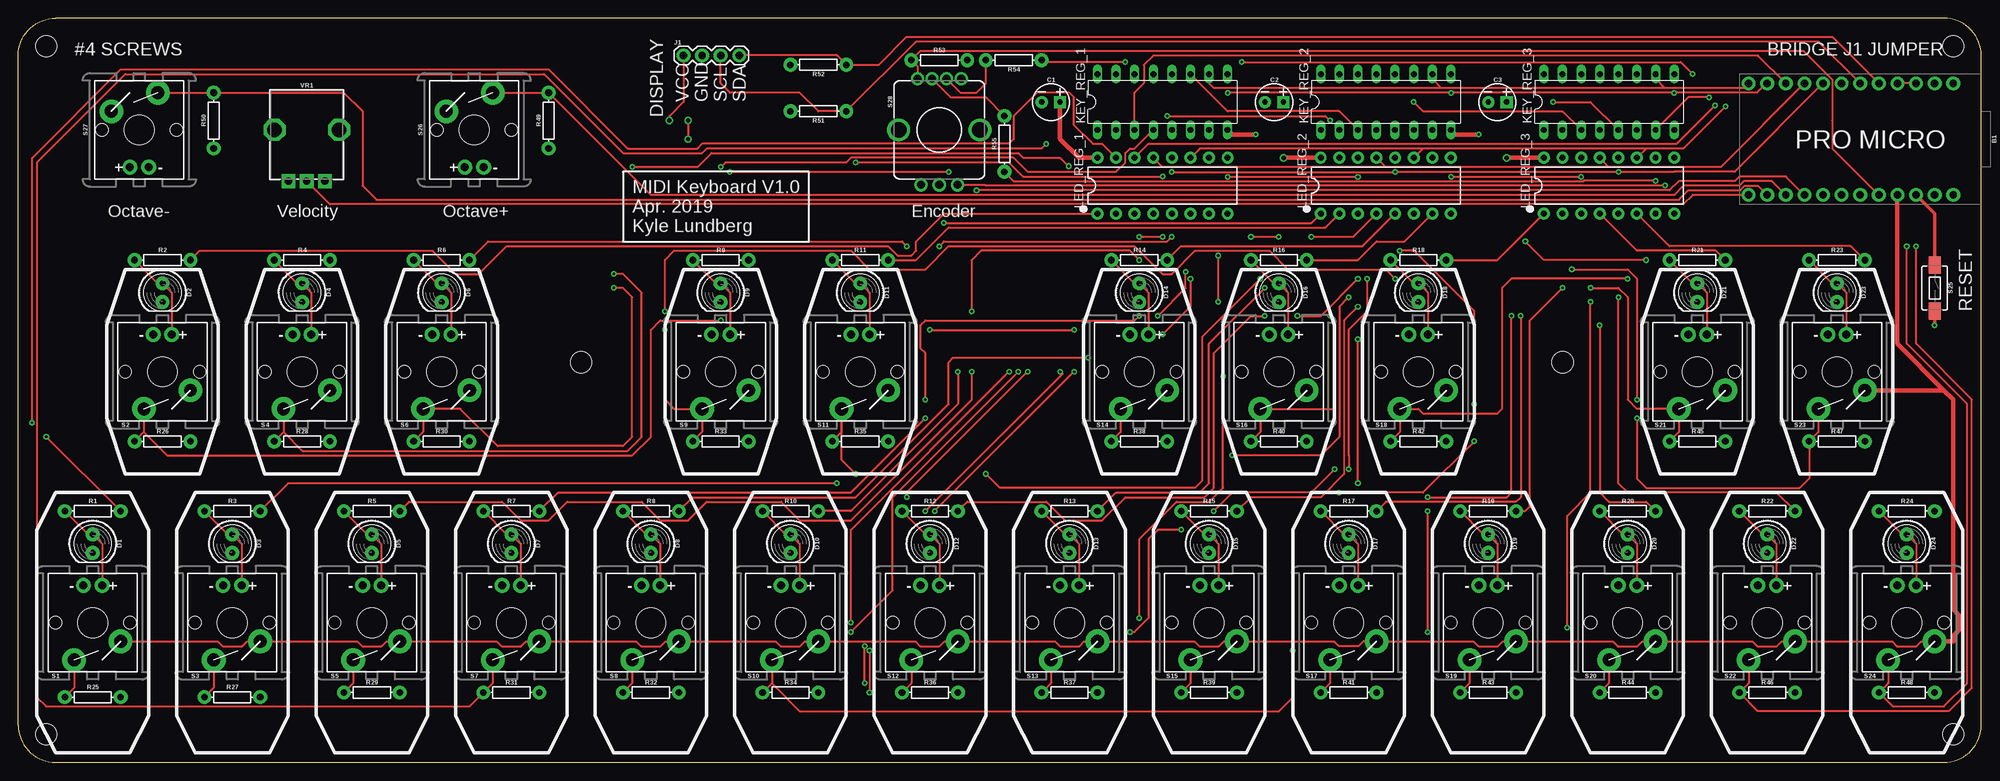
[diagram p3: board, top side]
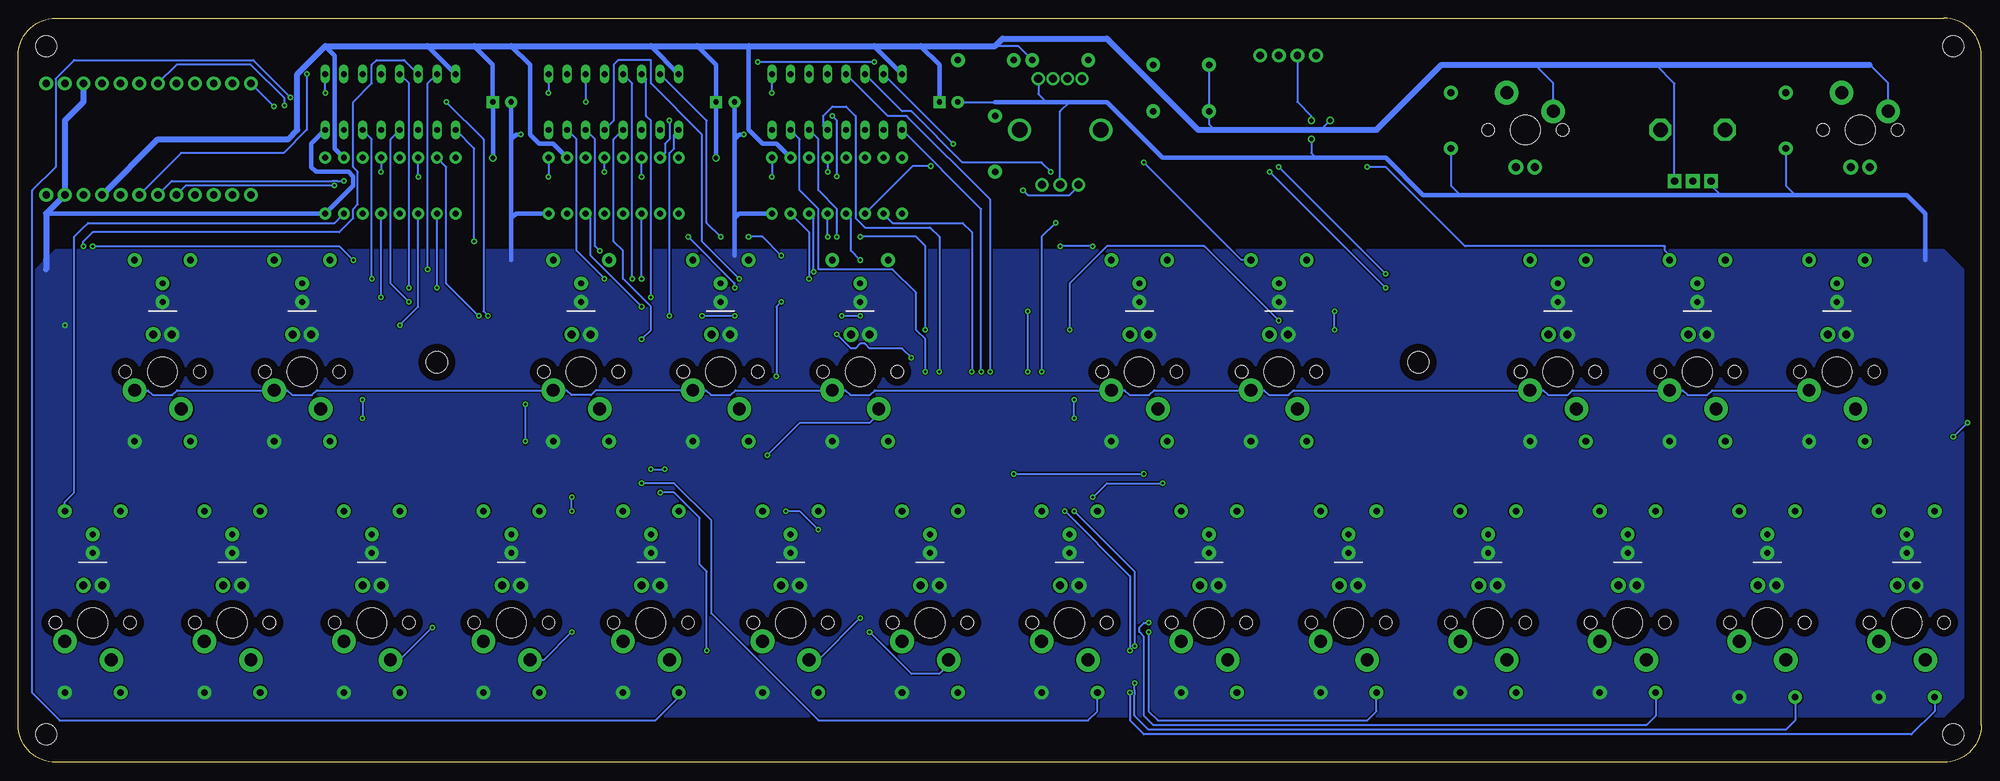
[diagram p4: board, bottom side, seen from below]

Size 267.97 x 101.6 mm. Coordinates in mm from the lower left corner, seen from the top.
Outline: 0,5.08 arc90 5.08,0 262.89,0 arc90 267.97,5.08 267.97,96.52 arc90 262.89,101.6 5.08,101.6 arc90 0,96.52 0,5.08
Copper layers (1*16): Top 0.035mm / dielectric 1.5mm / Bottom 0.035mm
Design rules "JLC_Rules_Approx *": minimum track width 3.5mil, minimum drill 0.35mm, track to track 6mil, track to pad 6mil, pad to pad 6mil, via to via 6mil, smd to smd 6mil, copper to edge 40mil, drill to drill 6mil, minimum pad ring 10mil, minimum via ring 8mil, stop-mask expansion 4mil, vias tented up to drill 0mil, thermal gap 0mil
Holes 2.95 mm at 76.83,54.61 210.82,54.61 3.81,97.79 264.16,97.79 3.81,3.81 264.16,3.81

### Footprints (pad centres in the part's own frame; a part is rotated, then mirrored left to right if it is on the bottom)
SPARKFUN_PRO_MICRO = drill 1.016 pad 1.88: 1 -7.62,12.7; 2 -7.62,10.16; 3 -7.62,7.62; 4 -7.62,5.08; 5 -7.62,2.54; 6 -7.62,0; 7 -7.62,-2.54; 8 -7.62,-5.08; 9 -7.62,-7.62; 10 -7.62,-10.16; 11 -7.62,-12.7; 12 -7.62,-15.24; 13 7.62,-15.24; 14 7.62,-12.7; 15 7.62,-10.16; 16 7.62,-7.62; 17 7.62,-5.08; 18 7.62,-2.54; 19 7.62,0; 20 7.62,2.54; 21 7.62,5.08; 22 7.62,7.62; 23 7.62,10.16; 24 7.62,12.7
CPOL-RADIAL-2.5MM-5MM = drill 0.7 pad 1.651 square: 1 1.25,0 | drill 0.7 pad 1.651: 2 -1.25,0
LED_5MM = drill 0.813 pad 1.88: A -1.27,0; K 1.27,0
1X04 = drill 1.016 pad 1.88: 1 0,0; 2 2.54,0; 3 5.08,0; 4 7.62,0
DIL16 = drill 0.813 long: 1 -8.89,-3.81; 2 -6.35,-3.81; 3 -3.81,-3.81; 4 -1.27,-3.81; 5 1.27,-3.81; 6 3.81,-3.81; 7 6.35,-3.81; 8 8.89,-3.81; 9 8.89,3.81; 10 6.35,3.81; 11 3.81,3.81; 12 1.27,3.81; 13 -1.27,3.81; 14 -3.81,3.81; 15 -6.35,3.81; 16 -8.89,3.81
DIP16 = drill 0.813 pad 1.626: 1 -8.89,-3.81; 2 -6.35,-3.81; 3 -3.81,-3.81; 4 -1.27,-3.81; 5 1.27,-3.81; 6 3.81,-3.81; 7 6.35,-3.81; 8 8.89,-3.81; 9 8.89,3.81; 10 6.35,3.81; 11 3.81,3.81; 12 1.27,3.81; 13 -1.27,3.81; 14 -3.81,3.81; 15 -6.35,3.81; 16 -8.89,3.81
AXIAL-0.3 = drill 0.9 pad 1.88: P$1 -3.81,0; P$2 3.81,0
CHERRY-MX-LED = drill 1.092 pad 2.032: A -1.27,-5.08; K 1.27,-5.08 | drill 1.753 pad 3.226: S1 -3.81,2.54; S2 2.54,5.08 | hole 4.089: 0,0 | hole 1.707: -5.08,0; 5.08,0
TACTILE_SWITCH_SMD_6.0X3.5MM = smd 2.3 x 1.6: 1 -3.15,0; 2 3.15,0
ENCODER_LED_2 = drill 1.1 pad 1.778: +G 1,7; +R -1,7; GND 3,7; SW -3,7 | drill 1.1 pad 1.8: A -2.5,-7.5; B 2.5,-7.5; C 0,-7.5 | drill 2.1: P$1 -5.55,0; P$2 5.55,0
POT-PTH-ALPS = drill 1 pad 1.88 square: P$1 7,-2.5; P$2 7,0; P$3 7,2.5 | drill 2 octagon: P$4 0,-4.4; P$5 0,4.4

### Placement (x,y rotation side)
B1  251.46,85.09 270 top
C1  140.97,90.17 0 top
C2  171.45,90.17 0 top
C3  201.93,90.17 0 top
D1  10.16,29.84 270 top
D2  19.68,64.14 270 top
D3  29.21,29.84 270 top
D4  38.73,64.14 270 top
D5  48.26,29.84 270 top
D6  57.78,64.14 270 top
D7  67.31,29.84 270 top
D8  86.36,29.84 270 top
D9  95.89,64.14 270 top
D10  105.41,29.84 270 top
D11  114.94,64.14 270 top
D12  124.46,29.84 270 top
D13  143.51,29.84 270 top
D14  153.03,64.14 270 top
D15  162.56,29.84 270 top
D16  172.09,64.14 270 top
D17  181.61,29.84 270 top
D18  191.13,64.14 270 top
D19  200.66,29.84 270 top
D20  219.71,29.84 270 top
D21  229.24,64.14 270 top
D22  238.76,29.84 270 top
D23  248.28,64.14 270 top
D24  257.81,29.84 270 top
J1  90.81,96.54 0 top
KEY_REG_1  156.21,90.17 0 top
KEY_REG_2  186.69,90.17 0 top
KEY_REG_3  217.17,90.17 0 top
LED_REG_1  156.21,78.74 0 top
LED_REG_2  186.69,78.74 0 top
LED_REG_3  217.17,78.74 0 top
R1  10.16,34.29 0 top
R2  19.68,68.58 0 top
R3  29.21,34.29 0 top
R4  38.73,68.58 0 top
R5  48.26,34.29 0 top
R6  57.78,68.58 0 top
R7  67.31,34.29 0 top
R8  86.36,34.29 0 top
R9  95.89,68.58 0 top
R10  105.41,34.29 0 top
R11  114.94,68.58 0 top
R12  124.46,34.29 0 top
R13  143.51,34.29 0 top
R14  153.03,68.58 0 top
R15  162.56,34.29 0 top
R16  172.09,68.58 0 top
R17  181.61,34.29 0 top
R18  191.13,68.58 0 top
R19  200.66,34.29 0 top
R20  219.71,34.29 0 top
R21  229.24,68.58 0 top
R22  238.76,34.29 0 top
R23  248.28,68.58 0 top
R24  257.81,34.29 0 top
R25  10.16,8.89 0 top
R26  19.68,43.81 0 top
R27  29.21,8.89 0 top
R28  38.73,43.81 0 top
R29  48.26,9.53 0 top
R30  57.78,43.81 0 top
R31  67.31,9.53 0 top
R32  86.36,9.53 0 top
R33  95.89,43.81 0 top
R34  105.41,9.53 0 top
R35  114.94,43.81 0 top
R36  124.46,9.53 0 top
R37  143.51,9.53 0 top
R38  153.03,43.81 0 top
R39  162.56,9.53 0 top
R40  172.09,43.81 0 top
R41  181.61,9.53 0 top
R42  191.13,43.81 0 top
R43  200.66,9.53 0 top
R44  219.71,9.53 0 top
R45  229.24,43.81 0 top
R46  238.76,9.53 0 top
R47  248.28,43.81 0 top
R48  257.81,9.53 0 top
R49  72.39,87.63 90 top
R50  26.67,87.63 90 top
R51  109.22,88.9 180 top
R52  109.22,95.25 180 top
R53  125.73,95.89 0 top
R54  135.89,95.89 180 top
R55  134.62,84.45 90 top
S1  10.16,19.05 180 top
S2  19.68,53.34 180 top
S3  29.21,19.05 180 top
S4  38.73,53.34 180 top
S5  48.26,19.05 180 top
S6  57.78,53.34 180 top
S7  67.31,19.05 180 top
S8  86.36,19.05 180 top
S9  95.89,53.34 180 top
S10  105.41,19.05 180 top
S11  114.94,53.34 180 top
S12  124.46,19.05 180 top
S13  143.51,19.05 180 top
S14  153.03,53.34 180 top
S15  162.56,19.05 180 top
S16  172.09,53.34 180 top
S17  181.61,19.05 180 top
S18  191.13,53.34 180 top
S19  200.66,19.05 180 top
S20  219.71,19.05 180 top
S21  229.24,53.34 180 top
S22  238.76,19.05 180 top
S23  248.28,53.34 180 top
S24  257.81,19.05 180 top
S25  261.62,64.77 270 top
S26  62.23,86.36 0 top
S27  16.51,86.36 0 top
S28  125.73,86.36 0 top
VR1  39.37,86.36 270 top

### Tracks (layer width: path | path; a pad name or v marks a point on that pad's centre or on a via)
ENCODER_ANALOG  (via drill 0.35)
  Top 0.305: S28.B 131.96,78.86 132.08,78.74 224.79,78.74 v224.79,78.76
  Bottom 0.305: v224.79,78.76 245.09,78.76 B1.17
ENCODER_DIGITAL  (via drill 0.35)
  Top 0.305: B1.16 241.3,80.01 234.95,80.01 234.31,79.38 226.69,79.38 225.43,78.11 130.83,78.11 v130.81,78.13
  Bottom 0.305: v130.81,78.13 130.15,77.47 124.46,77.47 123.23,78.7 S28.A
ENCODER_GREEN  (via drill 0.35)
  Top 0.305: R54.P$1 139.98,95.61 v151.13,95.61 | v167,95.61 226.95,95.61 v228.59,93.97
  Bottom 0.305: v151.13,95.61 v167,95.61 | v228.59,93.97 228.59,86.37 231.78,83.19 245.75,83.19 B1.19
ENCODER_RED  (via drill 0.35)
  Top 0.305: v223.52,79.4 213.72,79.4 213.63,79.31 135.96,79.31 R55.P$1
  Bottom 0.305: B1.18 247.01,79.38 225.11,79.38 225.06,79.42 224.52,79.42 224.47,79.38 223.54,79.38 v223.52,79.4
ENCODER_SWITCH
  Top 0.305: S28.SW 122.73,95.08 R53.P$1 123.19,97.16 243.69,97.16 247.62,93.23 247.62,87.66 247.65,87.63 247.65,83.82 B1.20
GND  (via drill 0.35, 0.6)
  Top 0.305: v91.44,87.63 v91.44,85.09 | B1.3 B1.4
  Top 0.508: S25.2 v261.62,59.69
  Top 0.61: v168.91,85.72 165.74,85.72 KEY_REG_1.8 | KEY_REG_2.8 196.22,85.72 v199.39,85.72
  Bottom 0.305: J1.2 93.35,90.2 93.36,90.19 91.44,88.27 v91.44,87.63 | R50.P$1 26.67,78.74 25.4,77.47 | VR1.P$1 36.87,78.78 35.56,77.47 | v91.44,85.09 91.44,83.19 90.81,82.55 | R49.P$1 72.39,78.74 71.12,77.47 | S28.GND 128.73,91.27 127.64,90.17 | 124.46,90.17 125.73,88.9 S28.C | C1.2 134.62,90.17
  Bottom 0.61: 134.62,90.17 127.64,90.17 124.46,90.17 119.38,90.17 111.76,82.55 90.81,82.55 81.28,82.55 76.2,77.47 71.12,77.47 35.56,77.47 25.4,77.47 10.16,77.47 7.62,74.93 7.62,68.58 | C2.2 170.2,85.09 | 170.2,85.09 170.2,74.3 | 170.2,74.3 170.2,69.23 170.18,69.22 | 170.2,74.3 169.56,74.93 LED_REG_1.8 | 170.2,85.09 169.56,85.72 v168.91,85.72 | v199.39,85.72 200.03,85.72 200.66,85.09 | 200.66,85.09 200.66,74.3 | 200.66,74.3 200.66,68.58 | C3.2 200.68,85.11 200.66,85.09 | 200.66,74.3 200.03,74.93 LED_REG_2.8 | 264.16,74.93 LED_REG_3.8 222.25,78.74 222.25,80.01 222.88,80.64 227.33,80.64 227.97,81.28 227.97,84.45 KEY_REG_3.8
  Bottom 0.813: 264.16,67.31 264.16,68.58 264.16,74.93 263.52,75.56 B1.23 261.62,87.63 259.08,90.17 B1.3
  pour Bottom: 265.43,8.89 262.89,6.35 5.08,6.35 2.54,8.89 2.54,67.31 5.08,69.85 262.89,69.85 265.43,67.31
KEY_DATA
  Top 0.305: KEY_REG_1.3 152.4,91.44 153.67,92.71 153.67,95.25 154.94,96.52 237.49,96.52 B1.10
KEY_LATCH  (via drill 0.35)
  Top 0.305: v165.1,91.42 165.1,91.44 165.12,91.42 v195.58,91.42 v226.06,91.42 226.11,91.47 237.37,91.47 238.62,92.71 B1.11
  Bottom 0.305: v226.06,91.42 KEY_REG_3.9 | v165.1,91.42 KEY_REG_1.9 | KEY_REG_2.9 v195.58,91.42
KREG2-1_DATA
  Top 0.305: KEY_REG_2.3 180.34,88.9 165.1,88.9 KEY_REG_1.11
KREG3-2_DATA  (via drill 0.35)
  Top 0.305: v190.5,90.17 191.77,88.9 210.82,88.9 KEY_REG_3.3
  Bottom 0.305: KEY_REG_2.11 v190.5,90.17
LED1-1  (via drill 0.35)
  Top 0.305: LED_REG_1.15 147.96,84.45 146.69,84.45 144.15,87 144.15,90.81 143.51,91.44 139.06,91.44 135.89,88.27 135.89,85.09 135.25,84.45 93.34,84.45 92.71,83.82 83.19,83.82 72.39,94.61 13.97,94.61 1.88,82.53 v1.88,46.35 | R1.P$2 v3.81,44.45
  Bottom 0.305: v3.81,44.45 1.91,46.35 v1.88,46.35
LED1-2
  Top 0.305: LED_REG_1.1 126.36,74.93 122.56,71.12 122.56,69.85 121.92,69.22 120.02,69.22 118.75,70.48 66.67,70.48 62.87,66.67 59.69,66.67 56.52,69.85 24.77,69.85 R2.P$2
LED1-3  (via drill 0.35)
  Top 0.305: v137.79,53.34 121.28,36.83 v121.28,36.2 | v111.76,38.1 36.83,38.1 R3.P$2
  Bottom 0.305: v121.28,36.2 119.38,38.1 v111.76,38.1 | LED_REG_1.2 148.59,73.66 139.06,73.66 137.79,72.39 v137.79,53.34
LED1-4  (via drill 0.35)
  Top 0.305: v143.38,81.41 142.24,82.55 137.16,82.55 136.53,83.19 94.61,83.19 92.71,81.28 v83.82,81.28
  Bottom 0.305: LED_REG_1.3 145.92,81.41 v143.38,81.41 | v83.82,81.28 81.28,81.28 70.48,70.48 43.18,70.48 43.18,69.85 42.55,69.22 R4.P$2
LED1-5  (via drill 0.35)
  Top 0.305: v153.03,68.58 151.76,69.85 131.44,69.85 130.18,68.58 v130.18,61.59 | v130.18,53.34 130.18,49.53 113.67,33.02 106.68,33.02 104.14,35.56 93.98,35.56 91.44,33.02 87.63,33.02 85.09,35.56 74.93,35.56 72.39,33.02 68.58,33.02 66.04,35.56 53.34,35.56 R5.P$2
  Bottom 0.305: LED_REG_1.4 154.31,74.3 154.31,69.85 v153.03,68.58 | v130.18,61.59 v130.18,53.34
LED1-6  (via drill 0.35)
  Top 0.305: v157.48,71.75 156.84,71.12 126.36,71.12 v125.73,70.48 | v121.28,70.48 120.65,71.12 64.14,71.12 R6.P$2
  Bottom 0.305: v157.48,71.75 LED_REG_1.5 | v121.28,70.48 v125.73,70.48
LED1-7  (via drill 0.35)
  Top 0.305: v153.03,60.96 152.4,60.33 123.83,60.33 123.19,59.69 123.19,56.52 123.83,55.88 v123.83,49.53 | R7.P$2 73.66,36.83 86.06,36.83 86.09,36.81 88.88,36.81 88.9,36.83 113.67,36.83 v123.83,46.99 | v155.57,60.96 159.36,64.75 v159.36,66.99
  Bottom 0.305: LED_REG_1.6 159.38,74.3 159.38,67.02 v159.36,66.99 | v153.03,60.96 v155.57,60.96 | v123.83,46.99 v123.83,49.53
LED1-8  (via drill 0.35)
  Top 0.305: v146.05,55.24 127.64,55.24 127,54.61 127,48.9 114.3,36.2 92.08,36.2 R8.P$2 | v160.02,66.04 160.02,62.23 v156.21,58.42
  Bottom 0.305: LED_REG_1.7 160.02,72.39 v160.02,66.04 | v146.05,55.24 147.32,56.52 151.76,56.52 152.4,57.15 153.03,57.15 153.67,56.52 154.31,56.52 v156.21,58.42
LED2-1  (via drill 0.35)
  Top 0.305: v179.07,87.63 178.44,88.27 v156.84,88.27 | v156.21,80.01 137.16,80.01 135.25,81.92 114.32,81.92 v114.3,81.89
  Bottom 0.305: LED_REG_2.15 179.71,83.19 179.71,84.45 179.07,85.09 v179.07,87.63 | v156.84,88.27 156.21,87.63 v156.21,80.01 | R9.P$2 100.97,68.58 114.28,81.89 v114.3,81.89
LED2-2  (via drill 0.35)
  Top 0.305: LED_REG_2.1 176.53,73.66 v126.36,73.66 | v128.27,53.34 128.27,48.9 113.67,34.29 R10.P$2
  Bottom 0.305: v126.36,73.66 128.27,71.75 v128.27,53.34
LED2-3
  Top 0.305: LED_REG_2.2 178.44,73.03 127,73.03 122.56,68.58 R11.P$2
LED2-4  (via drill 0.35)
  Top 0.305: R12.P$2 129.54,35.56 140.34,35.56 142.88,33.02 147.96,33.02 151.13,36.2 161.93,36.2 163.19,37.47 163.19,55.88 168.28,60.96 v170.18,60.96 | v174.62,60.96 177.8,60.96 v182.88,66.04
  Bottom 0.305: v182.88,66.04 LED_REG_2.3 | v170.18,60.96 v174.62,60.96
LED2-5  (via drill 0.35)
  Top 0.305: LED_REG_2.4 182.25,71.75 v176.53,71.75 | v170.18,64.77 162.56,57.15 162.56,38.1 161.29,36.83 149.86,36.83 R13.P$2
  Bottom 0.305: v176.53,71.75 170.18,65.41 v170.18,64.77
LED2-6
  Top 0.305: LED_REG_2.5 183.51,70.48 158.75,70.48 R14.P$2
LED2-7  (via drill 0.35)
  Top 0.305: v182.88,62.23 180.97,60.33 180.97,39.37 177.8,36.2 168.28,36.2 R15.P$2
  Bottom 0.305: LED_REG_2.6 189.87,74.3 189.87,69.22 v182.88,62.23
LED2-8
  Top 0.305: LED_REG_2.7 189.23,71.12 185.42,71.12 182.88,68.58 R16.P$2
LED3-1  (via drill 0.35)
  Top 0.305: R17.P$2 186.69,35.56 204.47,35.56 205.1,36.2 v205.1,60.96
  Bottom 0.305: LED_REG_3.15 209.55,81.28 209.55,65.41 v205.1,60.96
LED3-2
  Top 0.305: LED_REG_3.1 201.93,68.58 R18.P$2
LED3-3  (via drill 0.35)
  Top 0.305: v210.82,64.77 206.38,60.33 206.38,34.92 205.74,34.29 R19.P$2
  Bottom 0.305: v210.82,64.77 LED_REG_3.2
LED3-4  (via drill 0.35)
  Top 0.305: v215.9,59.69 215.9,36.83 217.17,35.56 222.25,35.56 R20.P$2
  Bottom 0.305: v215.9,59.69 213.36,62.23 LED_REG_3.3
LED3-5
  Top 0.305: LED_REG_3.4 220.98,69.85 231.78,69.85 R21.P$2
LED3-6  (via drill 0.35)
  Top 0.305: v218.44,63.5 218.44,38.1 219.71,36.83 240.03,36.83 R22.P$2
  Bottom 0.305: v218.44,63.5 LED_REG_3.5
LED3-7
  Top 0.305: LED_REG_3.6 225.43,70.48 250.19,70.48 R23.P$2
LED3-8
  Bottom 0.305: LED_REG_3.7 224.79,73.66 258.44,73.66 259.26,72.85 259.27,72.85 260.35,71.77 260.35,36.83 261.62,35.56 R24.P$2
LED_DATA  (via drill 0.35)
  Top 0.305: LED_REG_1.14 154.31,84.45 226.4,84.45 v231.63,89.68
  Bottom 0.305: v231.63,89.68 231.63,90.66 236.22,95.25 246.38,95.25 B1.7
LED_LATCH  (via drill 0.35)
  Top 0.305: B1.8 234.31,80.64 226.06,80.64 226.04,80.62 v218.44,80.62 v187.96,80.62 v157.48,80.62
  Bottom 0.305: v187.96,80.62 LED_REG_2.12 | LED_REG_3.12 v218.44,80.62 | LED_REG_1.12 v157.48,80.62
LED_OUTPUT_EN
  Top 0.305: B1.9 232.41,81.28 217.17,81.28 | LED_REG_1.13 156.21,81.28 186.69,81.28 | 217.17,81.28 186.69,81.28 | LED_REG_2.13 186.69,81.28 | LED_REG_3.13 217.17,81.28
LREG1-2_DATA  (via drill 0.35)
  Top 0.305: v165.1,79.97 v182.88,79.97
  Bottom 0.305: LED_REG_1.9 v165.1,79.97 | v182.88,79.97 LED_REG_2.14
LREG2-3_DATA  (via drill 0.35)
  Top 0.305: v195.58,79.97 v213.36,79.97
  Bottom 0.305: LED_REG_2.9 v195.58,79.97 | v213.36,79.97 LED_REG_3.14
N$1
  Top 0.305: R1.P$1 9.53,31.11 D1.A 11.43,29.84 S1.A
N$2
  Top 0.305: R2.P$1 19.05,65.41 D2.A 20.95,64.14 S2.A
N$3
  Top 0.305: R3.P$1 28.57,31.11 D3.A 30.48,29.84 S3.A
N$4
  Top 0.305: R4.P$1 38.1,65.41 D4.A 40.01,64.14 S4.A
N$5
  Top 0.305: R5.P$1 47.62,31.11 D5.A 49.53,29.84 S5.A
N$6
  Top 0.305: R6.P$1 57.15,65.41 D6.A 59.05,64.14 S6.A
N$7
  Top 0.305: R7.P$1 66.67,31.11 D7.A 68.58,29.84 S7.A
N$8
  Top 0.305: R8.P$1 85.72,31.11 D8.A 87.63,29.84 S8.A
N$9
  Top 0.305: R9.P$1 95.25,65.41 D9.A 97.16,64.14 S9.A
N$10
  Top 0.305: R10.P$1 104.78,31.11 D10.A 106.68,29.84 S10.A
N$11
  Top 0.305: R11.P$1 114.3,65.41 D11.A 116.2,64.14 S11.A
N$12
  Top 0.305: R12.P$1 123.83,31.11 D12.A 125.73,29.84 S12.A
N$13
  Top 0.305: R13.P$1 142.88,31.11 D13.A 144.78,29.84 S13.A
N$14
  Top 0.305: R14.P$1 152.4,65.41 D14.A 154.31,64.14 S14.A
N$15
  Top 0.305: R15.P$1 161.93,31.11 D15.A 163.83,29.84 S15.A
N$16
  Top 0.305: R16.P$1 171.45,65.41 D16.A 173.35,64.14 S16.A
N$17
  Top 0.305: R17.P$1 180.97,31.11 D17.A 182.88,29.84 S17.A
N$18
  Top 0.305: R18.P$1 190.5,65.41 D18.A 192.41,64.14 S18.A
N$19
  Top 0.305: R19.P$1 200.03,31.11 D19.A 201.93,29.84 S19.A
N$20
  Top 0.305: R20.P$1 219.07,31.11 D20.A 220.98,29.84 S20.A
N$21
  Top 0.305: R21.P$1 228.6,65.41 D21.A 230.5,64.14 S21.A
N$22
  Top 0.305: R22.P$1 238.12,31.11 D22.A 240.03,29.84 S22.A
N$23
  Top 0.305: R23.P$1 247.65,65.41 D23.A 249.56,64.14 S23.A
N$24
  Top 0.305: R24.P$1 257.18,31.11 D24.A 259.08,29.84 S24.A
N$25
  Top 0.305: S28.+G 128.65,91.44 130.81,91.44 132.08,92.71 R54.P$2
N$26
  Top 0.305: S28.+R 127.28,90.81 132.08,90.81 R55.P$2
OCTAVE_DOWN
  Top 0.305: S27.S2 R50.P$2 43.18,91.44 44.45,91.44 46.99,88.9 46.99,78.74 48.9,76.83 226.69,76.83 227.97,78.11 235.09,78.11 235.7,78.72 236.19,78.72 236.22,78.74 237.49,78.74 B1.14
OCTAVE_UP
  Top 0.305: S26.S2 R49.P$2 86.36,77.47 226.06,77.47 227.33,78.74 234.95,78.74 235.59,79.38 239.4,79.38 B1.15
REGISTER_CLOCK  (via drill 0.35)
  Top 0.305: B1.12 235.59,92.08 224.79,92.08 | KEY_REG_1.10 162.56,92.71 163.19,92.08 194.31,92.08 | 224.79,92.08 194.31,92.08 | KEY_REG_3.10 223.52,93.34 224.79,92.08 | KEY_REG_2.10 193.04,93.34 194.31,92.08 | v233.04,89.53 227.33,83.82 222.25,83.82 | LED_REG_1.11 161.29,83.82 191.77,83.82 | 222.25,83.82 191.77,83.82 | LED_REG_2.11 191.77,83.82 | LED_REG_3.11 222.25,83.82
  Bottom 0.305: B1.12 v233.04,89.53
RESET
  Top 0.508: B1.22 261.62,74.93 S25.1
SCL
  Top 0.305: B1.6 245.75,98.42 122.56,98.42 R51.P$1 109.22,88.9 106.68,91.44 97.16,91.44 95.89,92.71 J1.3
SDA
  Top 0.305: B1.5 247.65,99.06 121.28,99.06 117.47,95.25 R52.P$1 111.74,96.54 J1.4
SWITCH1-1  (via drill 0.35)
  Top 0.305: S1.S2 7.62,10.16 R25.P$1 | v144.15,53.34 v125.09,34.29 | v116.2,15.24 v116.2,9.53
  Bottom 0.305: KEY_REG_1.7 161.29,85.09 161.29,78.11 158.75,75.56 158.75,67.31 148.59,67.31 145.41,64.14 145.41,59.05 144.15,57.78 v144.15,53.34 | v125.09,34.29 116.2,25.4 v116.2,15.24 | R25.P$1 6.35,6.99 9.53,3.81 114.3,3.81 116.2,5.71 v116.2,9.53
SWITCH1-2  (via drill 0.35)
  Top 0.305: S2.S2 17.14,45.09 | 17.14,45.09 R26.P$1 | v124.46,59.05 v144.15,59.05 | v95.89,60.33 87.63,60.33 86.36,59.05 86.36,44.45 83.82,41.91 20.32,41.91 17.14,45.09 | v153.03,71.78 v156.21,71.78
  Bottom 0.305: KEY_REG_1.6 158.75,85.09 158.75,78.11 156.21,75.56 v156.21,71.78 | v95.89,60.33 106.05,70.48 119.38,70.48 124.46,65.41 v124.46,59.05 | v144.15,59.05 144.15,70.48 145.41,71.75 153.03,71.75 v153.03,71.78
SWITCH1-3  (via drill 0.35)
  Top 0.305: S3.S2 26.67,10.16 R27.P$1 | v142.24,53.34 142.56,53.02 v123.83,34.29 | v115.55,10.79 115.55,15.84 v115.53,15.85
  Bottom 0.305: KEY_REG_1.5 158.12,87 158.12,88.27 156.84,89.53 154.94,89.53 153.67,88.27 153.67,74.3 152.4,73.03 143.51,73.03 142.24,71.75 v142.24,53.34 | R27.P$1 25.4,5.71 26.67,4.45 113.67,4.45 115.57,6.35 115.57,9.23 115.55,9.25 115.55,9.8 115.57,9.82 115.57,10.77 v115.55,10.79 | v115.53,15.85 115.53,26 v123.83,34.29
SWITCH1-4  (via drill 0.35)
  Top 0.305: S4.S2 36.2,45.09 | 36.2,45.09 R28.P$1 | KEY_REG_1.4 152.4,83.82 151.76,83.82 151.13,83.19 151.13,81.92 149.86,80.64 137.79,80.64 135.89,82.55 113.67,82.55 113.03,81.92 96.52,81.92 v95.89,81.28 | 36.2,45.09 38.73,42.55 83.19,42.55 85.09,44.45 85.09,64.14 82.55,66.67 v81.28,66.67
  Bottom 0.305: v95.89,81.28 v81.28,66.67
SWITCH1-5  (via drill 0.35)
  Top 0.305: S5.S2 45.72,10.79 R29.P$1 | v135.25,53.34 113.67,31.75 v113.67,19.05
  Bottom 0.305: KEY_REG_1.13 149.22,88.27 146.69,88.27 135.25,76.83 v135.25,53.34 | R29.P$1 44.45,6.35 45.72,5.08 113.03,5.08 114.3,6.35 114.3,17.14 114.94,17.78 114.94,18.41 114.3,19.05 v113.67,19.05
SWITCH1-6  (via drill 0.35)
  Top 0.305: R30.P$1 55.24,45.09 S6.S2 60.33,48.26 65.41,43.18 82.55,43.18 83.82,44.45 83.82,63.5 82.55,64.77 v81.28,64.77 | v97.16,80.64 v127,80.64
  Bottom 0.305: KEY_REG_1.14 147.32,88.9 146.05,88.9 139.06,81.92 128.27,81.92 v127,80.64 | v97.16,80.64 v81.28,64.77
SWITCH1-7  (via drill 0.35)
  Top 0.305: S7.S2 64.77,10.79 R31.P$1 61.59,7.62 3.81,7.62 2.54,8.89 2.54,81.92 14.61,93.98 71.75,93.98 82.55,83.19 93.34,83.19 93.98,83.82 139.7,83.82 v140.34,84.45
  Bottom 0.305: v140.34,84.45 KEY_REG_1.15
SWITCH1-8  (via drill 0.35)
  Top 0.305: S8.S2 83.82,10.79 R32.P$1 | v136.53,53.34 119.38,36.2 119.38,23.5 v113.67,17.78
  Bottom 0.305: KEY_REG_1.1 136.53,75.56 v136.53,53.34 | R32.P$1 82.55,6.99 83.82,5.71 112.39,5.71 113.67,6.99 v113.67,17.78
SWITCH2-1  (via drill 0.35)
  Top 0.305: R33.P$1 93.34,45.09 S9.S2 89.53,48.26 88.27,49.53 v88.27,59.05 | v187.96,66.04 186.69,67.31 173.35,67.31 170.81,69.85 160.66,69.85 157.48,66.67 156.21,66.67 152.4,70.48 127,70.48 123.83,67.31 116.2,67.31 113.67,69.85 89.53,69.85 88.27,68.58 v88.27,61.59
  Bottom 0.305: KEY_REG_2.7 191.77,85.09 191.77,69.85 v187.96,66.04 | v88.27,59.05 v88.27,61.59
SWITCH2-2  (via drill 0.35)
  Top 0.305: S10.S2 102.87,10.79 | 102.87,10.79 R34.P$1 | v188.59,69.85 190.5,69.85 198.75,61.59 v198.75,48.9 | v173.99,15.24 173.99,8.89 172.09,6.99 106.68,6.99 102.87,10.79 | v198.75,43.81 191.77,36.83 v180.34,36.83
  Bottom 0.305: KEY_REG_2.6 189.23,85.09 189.23,70.48 v188.59,69.85 | v173.99,15.24 173.99,26.04 174.94,26.99 174.94,33.34 178.44,36.83 v180.34,36.83 | v198.75,48.9 v198.75,43.81
SWITCH2-3  (via drill 0.35)
  Top 0.305: R35.P$1 112.39,45.09 S11.S2 112.39,41.27 v114.3,39.37 | v169.54,66.04 161.61,58.1 161.61,38.42 160.66,37.47 133.99,37.47 v132.08,39.37
  Bottom 0.305: KEY_REG_2.5 186.69,87.63 186.69,95.25 186.06,95.89 181.61,95.89 181.61,92.71 174.62,85.72 174.62,71.12 v169.54,66.04 | v132.08,39.37 v114.3,39.37
SWITCH2-4  (via drill 0.35)
  Top 0.305: S12.S2 121.92,10.79 R36.P$1 | v182.88,38.1 v182.88,57.78
  Bottom 0.305: KEY_REG_2.4 186.69,85.09 186.69,71.12 185.42,69.85 185.42,66.04 181.61,62.23 181.61,59.05 v182.88,57.78 | v182.88,38.1 178.44,38.1 173.35,33.02 173.35,20.32 158.75,5.71 121.92,5.71 120.65,6.99 R36.P$1
SWITCH2-5  (via drill 0.35)
  Top 0.305: S13.S2 140.97,10.79 R37.P$1 | v184.15,66.04 184.15,61.59 181.61,59.05 181.61,41.91 181.63,41.89 v181.63,40.01 | v151.76,17.78 152.4,17.78 154.31,19.68 154.31,30.48 155.57,31.75 v158.75,31.75 | v179.71,40.01 176.53,36.83 165.74,36.83 v163.19,34.29
  Bottom 0.305: KEY_REG_2.13 184.15,92.71 v184.15,66.04 | v151.76,17.78 146.05,12.06 142.24,12.06 140.97,13.34 S13.S2 | v181.63,40.01 v179.71,40.01 | v163.19,34.29 161.29,34.29 v158.75,31.75
SWITCH2-6  (via drill 0.35)
  Top 0.305: S14.S2 150.5,45.09 R38.P$1 | v181.61,63.5 180.34,62.23 180.34,44.45 177.8,41.91 v165.74,41.91
  Bottom 0.305: KEY_REG_2.14 182.25,93.34 182.25,88.27 181.61,87.63 v181.61,63.5 | v165.74,41.91 161.29,46.35 151.76,46.35 150.5,47.62 S14.S2
SWITCH2-7  (via drill 0.35)
  Top 0.305: S15.S2 160.02,10.79 R39.P$1 | v153.03,19.68 153.03,30.48 158.12,35.56 162.56,35.56 164.47,37.47 v164.47,52.7 | v163.83,62.87 v163.83,69.19 | v168.28,71.75 v172.09,71.75
  Bottom 0.305: KEY_REG_2.15 173.99,87.63 173.99,73.66 v172.09,71.75 | v153.03,19.68 158.75,13.97 S15.S2 | v163.83,62.87 164.47,62.23 v164.47,52.7 | v163.83,69.19 166.39,71.75 v168.28,71.75
SWITCH2-8  (via drill 0.35)
  Top 0.305: R40.P$1 169.54,45.09 S16.S2 179.71,48.26 179.71,60.33 v179.07,60.96
  Bottom 0.305: KEY_REG_2.1 178.44,85.72 178.44,83.82 179.07,83.19 v179.07,60.96
SWITCH3-1  (via drill 0.35)
  Top 0.305: KEY_REG_3.7 227.97,90.81 v230.82,90.81 | S17.S2 179.07,10.79 R41.P$1
  Bottom 0.305: v230.82,90.81 235.9,95.89 260.35,95.89 262.89,93.34 262.89,81.28 266.06,78.11 266.06,9.45 262.33,5.71 180.97,5.71 177.8,8.89 R41.P$1
SWITCH3-2  (via drill 0.35)
  Top 0.305: R42.P$1 188.59,45.09 S18.S2 191.13,48.26 191.77,47.62 201.93,47.62 202.56,48.26 202.56,64.77 203.84,66.04 v219.71,66.04
  Bottom 0.305: KEY_REG_3.6 219.71,85.09 v219.71,66.04
SWITCH3-3  (via drill 0.35)
  Top 0.305: S19.S2 198.12,10.79 R43.P$1 | KEY_REG_3.5 214.63,90.17 v209.55,90.17 | v203.84,60.96 203.84,36.83 203.2,36.2 192.43,36.2 v192.41,36.22 | v192.41,17.78 v192.41,34.29
  Bottom 0.305: v209.55,90.17 204.47,85.09 204.47,61.59 v203.84,60.96 | v192.41,17.78 196.22,13.97 S19.S2 | v192.41,34.29 v192.41,36.22
SWITCH3-4  (via drill 0.35)
  Top 0.305: S20.S2 217.17,10.79 R44.P$1 | v214.63,62.87 214.63,36.83 211.46,33.66 v211.46,18.41
  Bottom 0.305: KEY_REG_3.4 217.17,85.09 217.17,65.41 v214.63,62.87 | v211.46,18.41 215.9,13.97 S20.S2
SWITCH3-5  (via drill 0.35)
  Top 0.305: R45.P$1 226.69,45.09 S21.S2 220.98,48.26 219.71,49.53 219.71,63.5 218.44,64.77 v214.63,64.77
  Bottom 0.305: KEY_REG_3.13 214.63,92.71 v214.63,64.77
SWITCH3-6  (via drill 0.35)
  Top 0.305: S22.S2 236.22,10.79 R46.P$1 237.49,6.99 263.52,6.99 266.7,10.16 266.7,49.53 259.08,57.15 v259.08,70.48
  Bottom 0.305: KEY_REG_3.14 215.26,95.89 219.07,95.89 219.71,95.25 219.71,92.71 222.25,90.17 222.25,81.28 221.62,80.64 221.62,76.2 222.25,75.56 222.25,74.3 224.16,72.39 257.81,72.39 259.08,71.12 v259.08,70.48
SWITCH3-7  (via drill 0.35)
  Top 0.305: S23.S2 245.75,45.09 R47.P$1 244.47,38.73 243.21,37.47 222.25,37.47 220.98,38.73 v220.98,46.99 | v220.98,49.53 220.98,66.04 219.71,67.31 v212.09,67.31
  Bottom 0.305: KEY_REG_3.15 212.09,92.71 v212.09,67.31 | v220.98,49.53 v220.98,46.99
SWITCH3-8  (via drill 0.35)
  Top 0.305: S24.S2 255.27,10.79 R48.P$1 255.91,7.62 262.89,7.62 266.06,10.79 266.06,48.9 257.81,57.15 v257.81,70.48 | v205.74,71.12 208.28,68.58 v222.25,68.58
  Bottom 0.305: KEY_REG_3.1 205.74,83.82 v205.74,71.12 | v222.25,68.58 224.16,70.48 v257.81,70.48
VCC  (via drill 0.6)
  Top 0.305: S1.S1 27.21,16.51 27.88,15.84 30.54,15.84 31.21,16.51 S3.S1 46.26,16.51 46.93,15.84 49.59,15.84 50.26,16.51 S5.S1 65.31,16.51 65.98,15.84 68.64,15.84 69.31,16.51 S7.S1 84.36,16.51 85.03,15.84 87.69,15.84 88.36,16.51 S8.S1 103.41,16.51 104.08,15.84 106.74,15.84 107.41,16.51 S10.S1 122.46,16.51 123.13,15.84 125.79,15.84 126.46,16.51 S12.S1 141.51,16.51 142.18,15.84 144.84,15.84 145.51,16.51 S13.S1 160.56,16.51 161.23,15.84 163.89,15.84 164.56,16.51 S15.S1 179.61,16.51 180.28,15.84 182.94,15.84 183.61,16.51 S17.S1 198.66,16.51 199.33,15.84 201.99,15.84 202.66,16.51 S19.S1 217.71,16.51 218.38,15.84 221.04,15.84 221.71,16.51 S20.S1 236.76,16.51 237.43,15.84 240.09,15.84 240.76,16.51 S22.S1 255.81,16.51 256.48,15.84 259.14,15.84 259.81,16.51 S24.S1 | J1.1 90.81,90.2 90.82,90.19 88.9,88.27 v88.9,87.63
  Top 0.61: S24.S1 264.16,16.51 264.16,17.25 265.06,18.15 265.06,19.95 264.16,20.86 264.16,49.53 262.89,50.8 | B1.21 256.54,57.15 262.89,50.8 | S23.S1 262.89,50.8 | v172.72,82.55 LED_REG_2.16 | v203.2,82.55 LED_REG_3.16 | LED_REG_1.16 144.78,82.55 142.22,85.11 C1.1
  Bottom 0.305: S23.S1 250.29,50.8 249.62,50.13 246.95,50.13 246.28,50.8 S21.S1 231.24,50.8 230.57,50.13 227.9,50.13 227.23,50.8 S18.S1 193.14,50.8 192.47,50.13 189.8,50.13 189.13,50.8 S16.S1 174.09,50.8 173.42,50.13 170.75,50.13 170.08,50.8 S14.S1 155.04,50.8 154.37,50.13 151.7,50.13 151.03,50.8 S11.S1 116.94,50.8 116.27,50.13 113.6,50.13 112.93,50.8 S9.S1 97.89,50.8 97.22,50.13 94.55,50.13 93.88,50.8 S6.S1 59.79,50.8 59.12,50.13 56.45,50.13 55.78,50.8 S4.S1 40.74,50.8 40.07,50.13 37.4,50.13 36.73,50.8 S2.S1 | S27.S1 12.7,92.71 15.24,95.25 | S26.S1 58.42,92.71 60.96,95.25 | v88.9,87.63 90.17,86.36 91.44,86.36 | R53.P$2 131.44,97.79 134.62,97.79 | VR1.P$3 41.87,92.67 44.45,95.25 | R52.P$2 R51.P$2 105.41,87.12 104.65,86.36
  Bottom 0.61: KEY_REG_1.16 151.13,97.79 | KEY_REG_2.16 181.61,97.79 | KEY_REG_3.16 212.09,97.79 | 175.26,97.79 172.7,95.23 C2.1 172.72,90.15 v172.72,82.55 | 205.74,97.79 203.2,95.25 203.2,90.19 C3.1 203.18,82.57 v203.2,82.55 | LED_REG_1.10 164.47,84.45 166.37,84.45 168.28,86.36 168.28,97.79 | LED_REG_2.10 194.94,84.45 196.85,84.45 198.12,85.72 198.12,95.25 200.66,97.79 | LED_REG_3.10 224.79,83.82 224.79,96.52 226.06,97.79 | C1.1 142.22,95.23 144.78,97.79
  Bottom 0.813: B1.21 248.92,85.09 231.14,85.09 229.87,86.36 229.87,93.98 226.06,97.79 212.09,97.79 205.74,97.79 200.66,97.79 181.61,97.79 175.26,97.79 168.28,97.79 151.13,97.79 144.78,97.79 134.62,97.79 133.58,98.83 119.38,98.83 106.91,86.36 104.65,86.36 91.44,86.36 82.55,86.36 73.66,95.25 60.96,95.25 44.45,95.25 15.24,95.25
VELPOT
  Top 0.305: B1.13 228.6,77.47 227.33,76.2 42.53,76.2 VR1.P$2

### Text on the board
tPlace: DISPLAY | #4 SCREWS | BRIDGE J1 JUMPER | VCC / GND / SCL / SDA | PRO MICRO | Octave- | Velocity | Octave+ | Encoder | MIDI Keyboard V1.0 / Apr. 2019 / Kyle Lundberg | RESET